# EAGLE design e_book_reader (EAGLE 9.7.0)
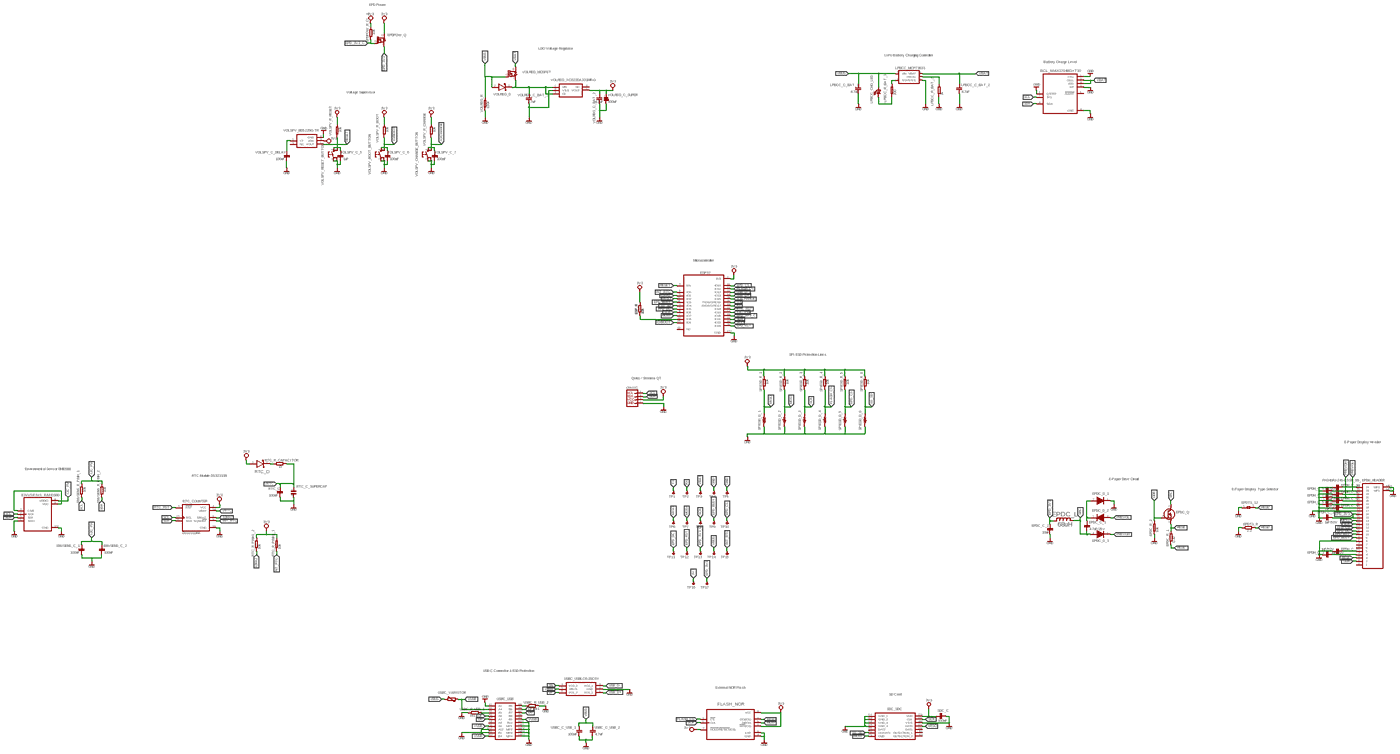
[diagram p0: schematic, sheet 1, overview]
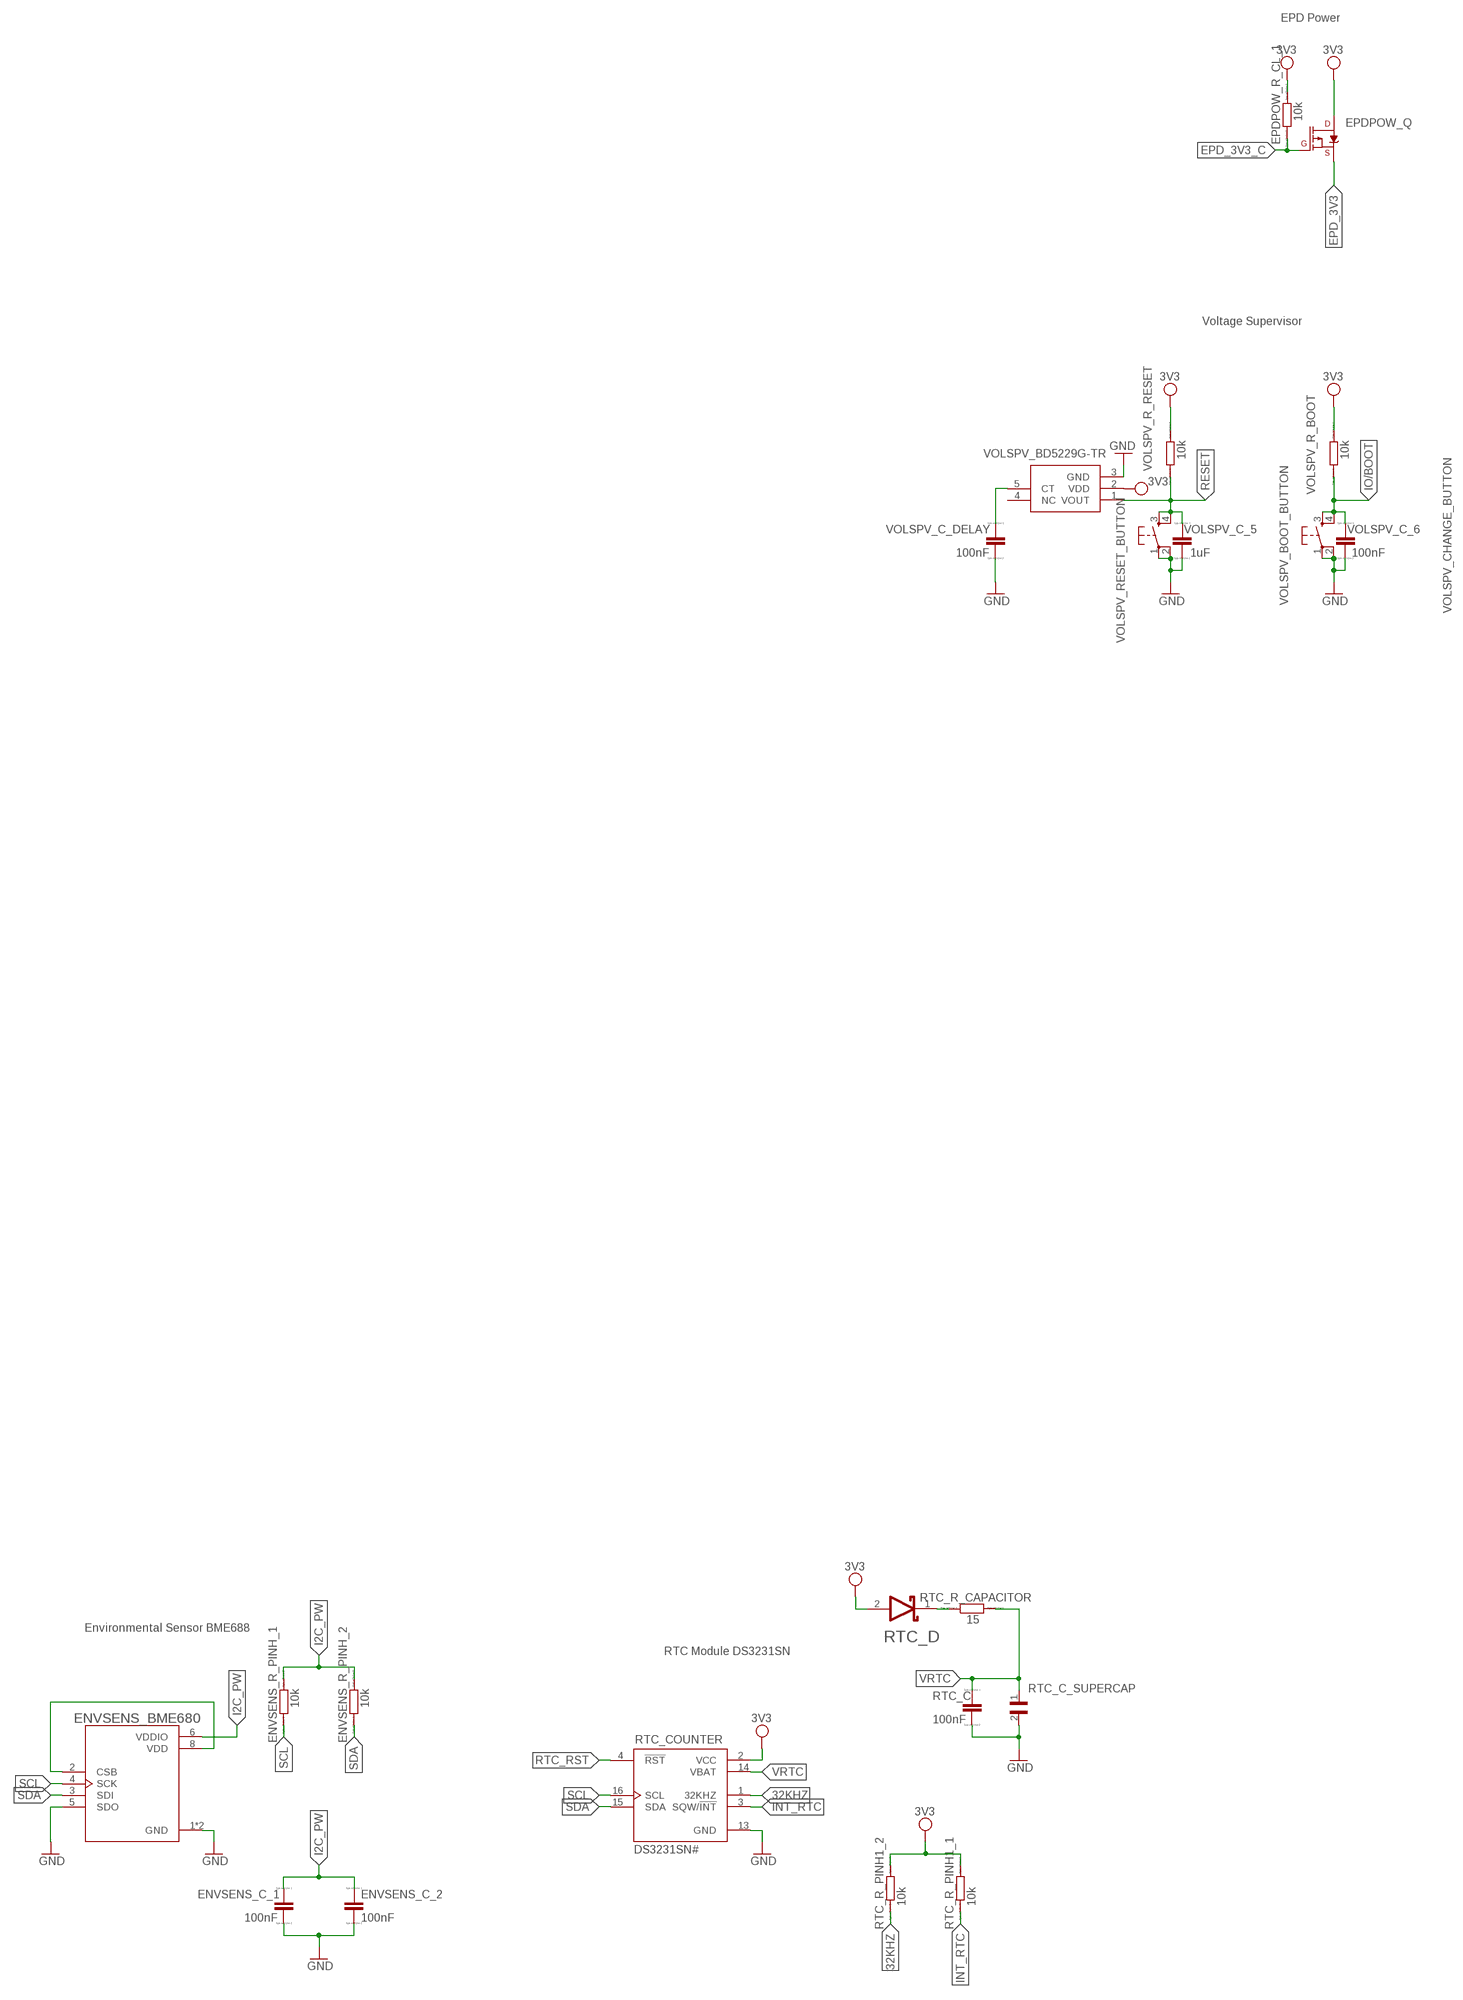
[diagram p1: schematic, sheet 1, part 1 of 5]
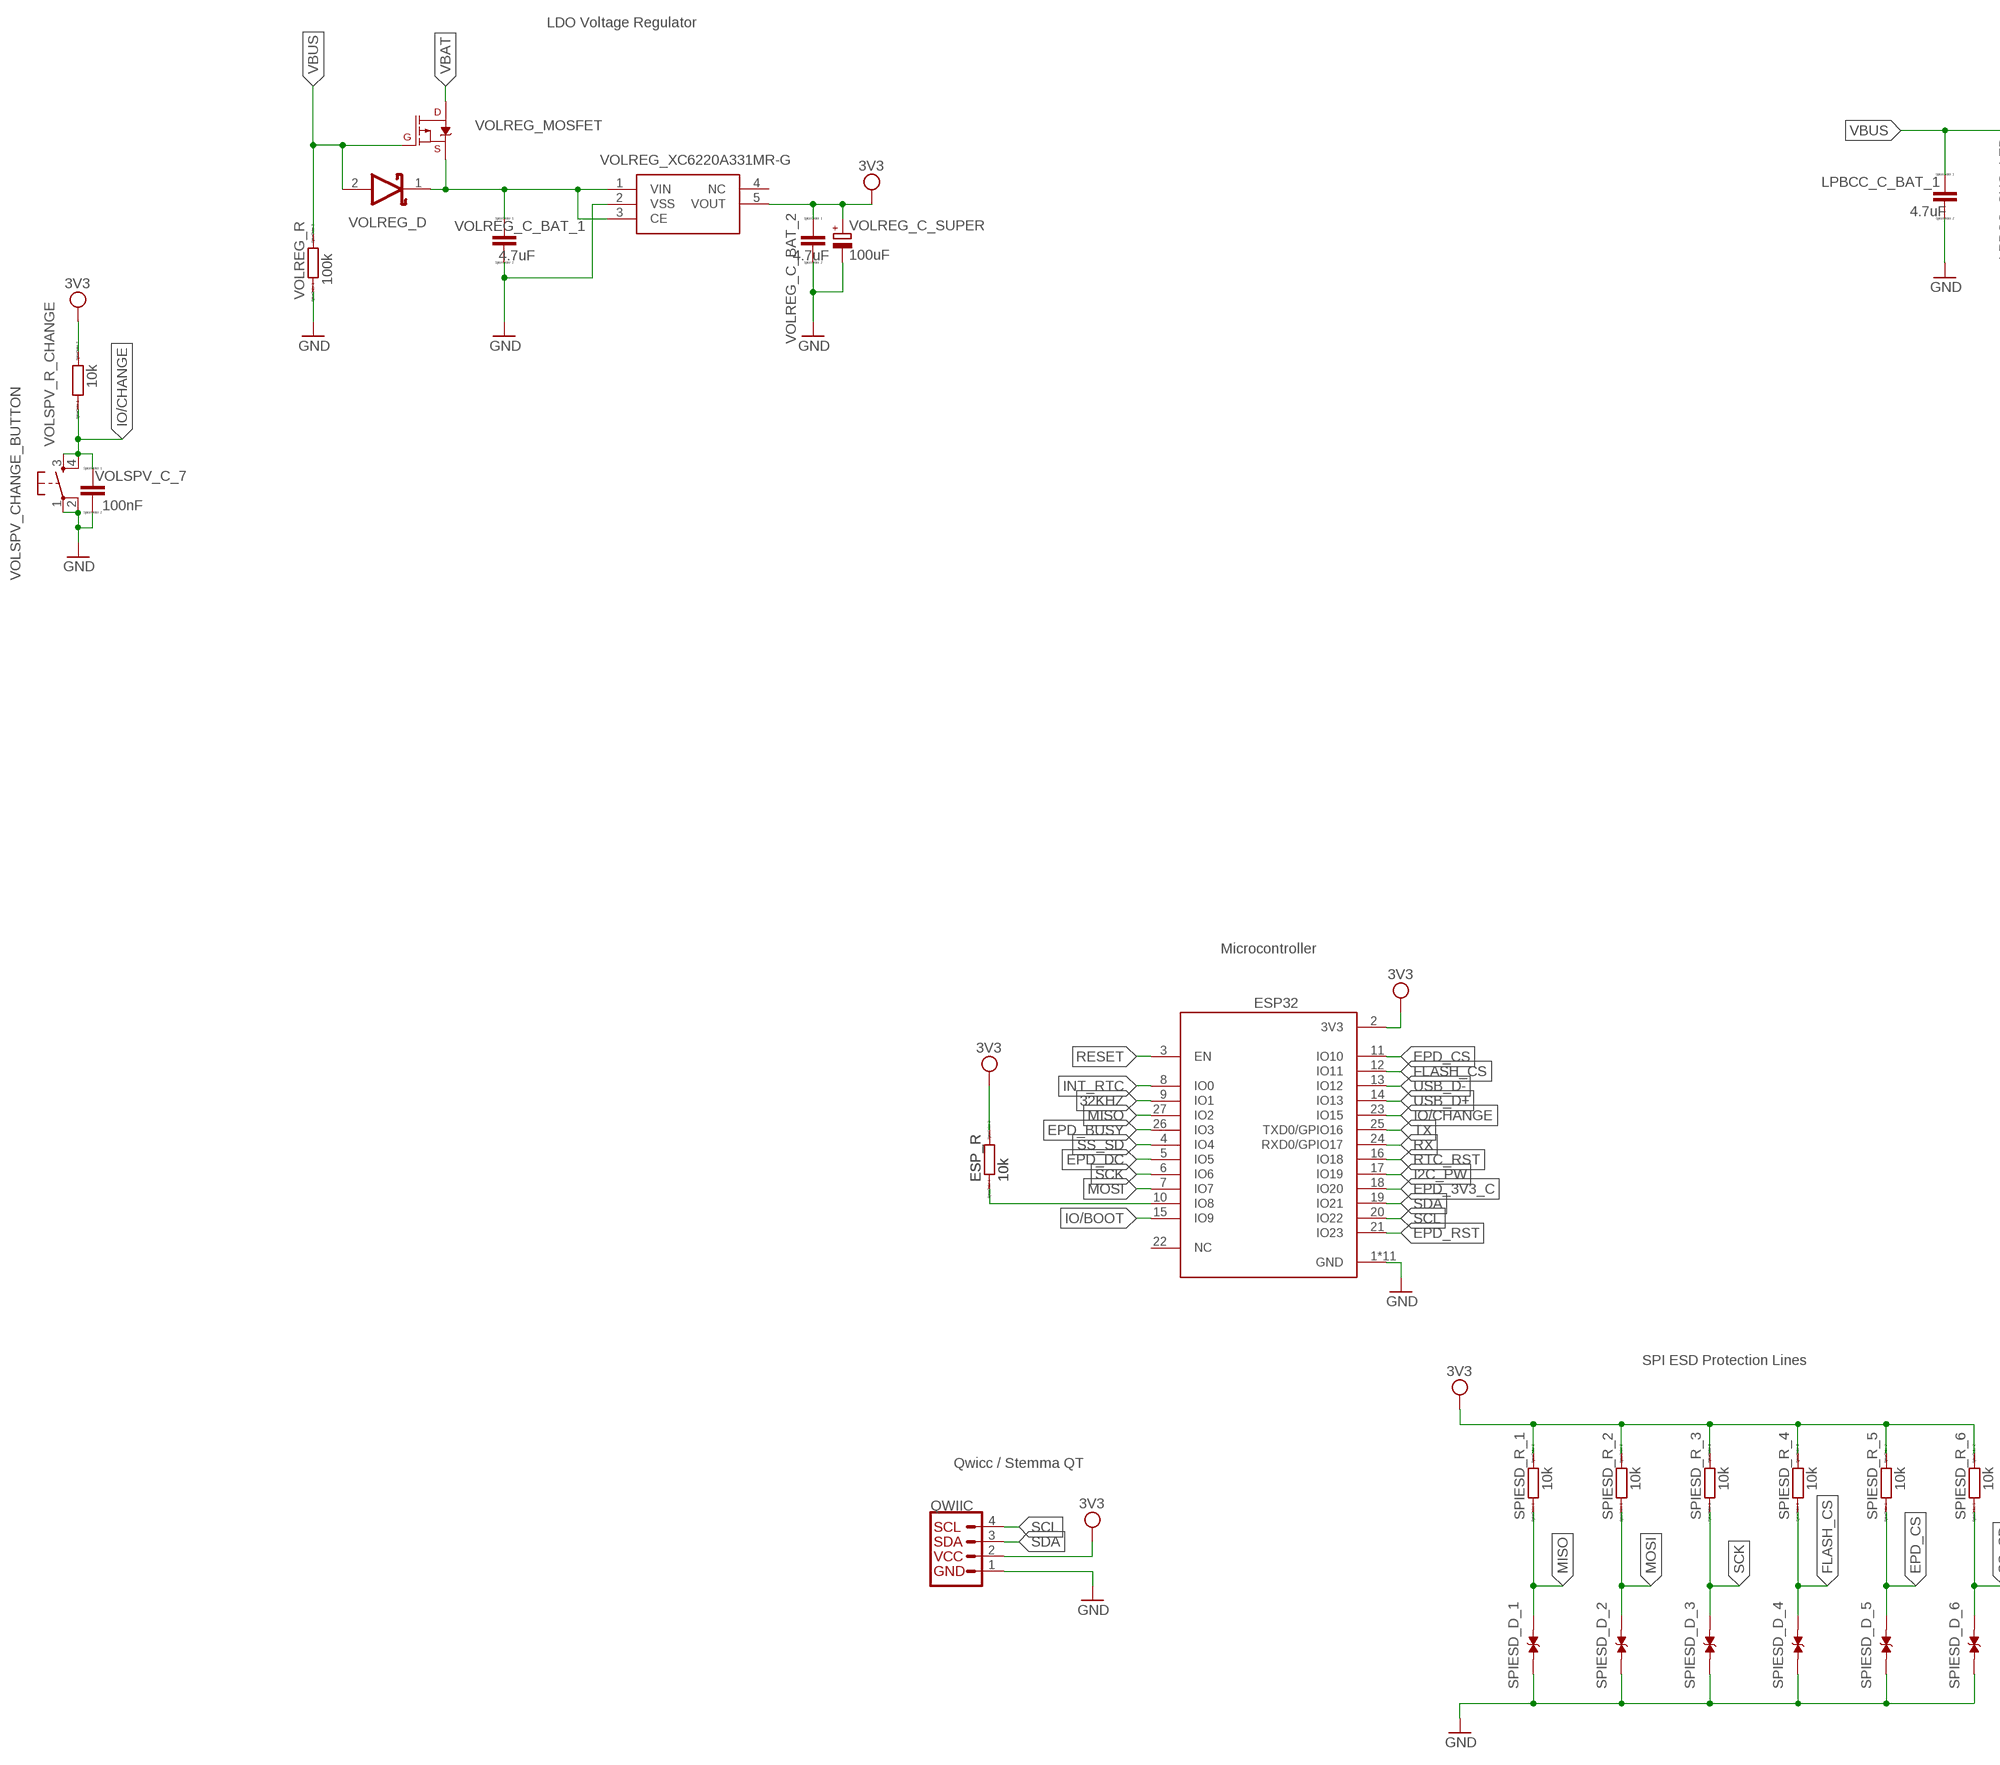
[diagram p2: schematic, sheet 1, part 2 of 5]
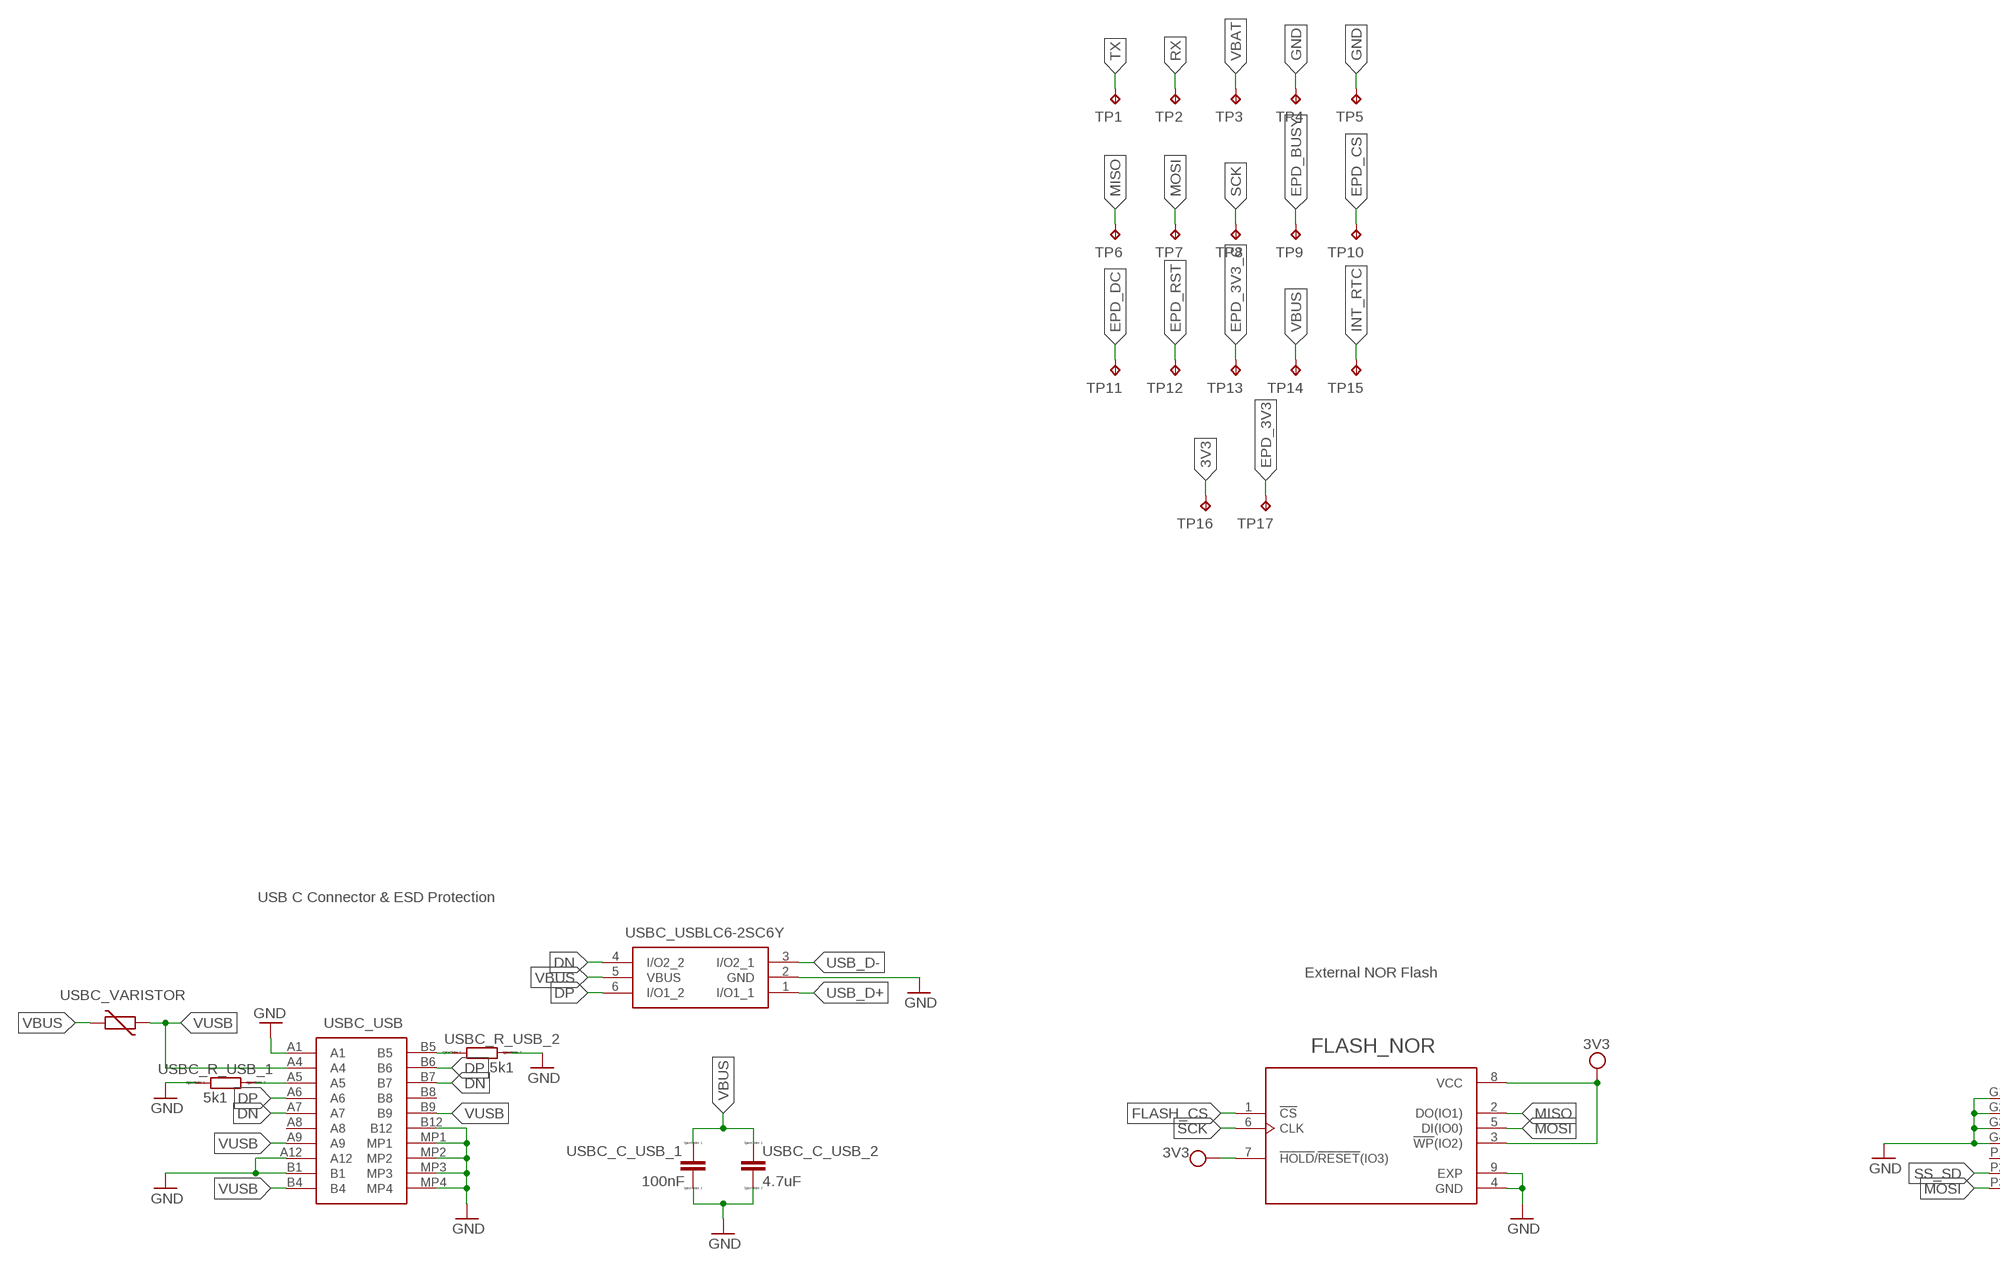
[diagram p3: schematic, sheet 1, part 3 of 5]
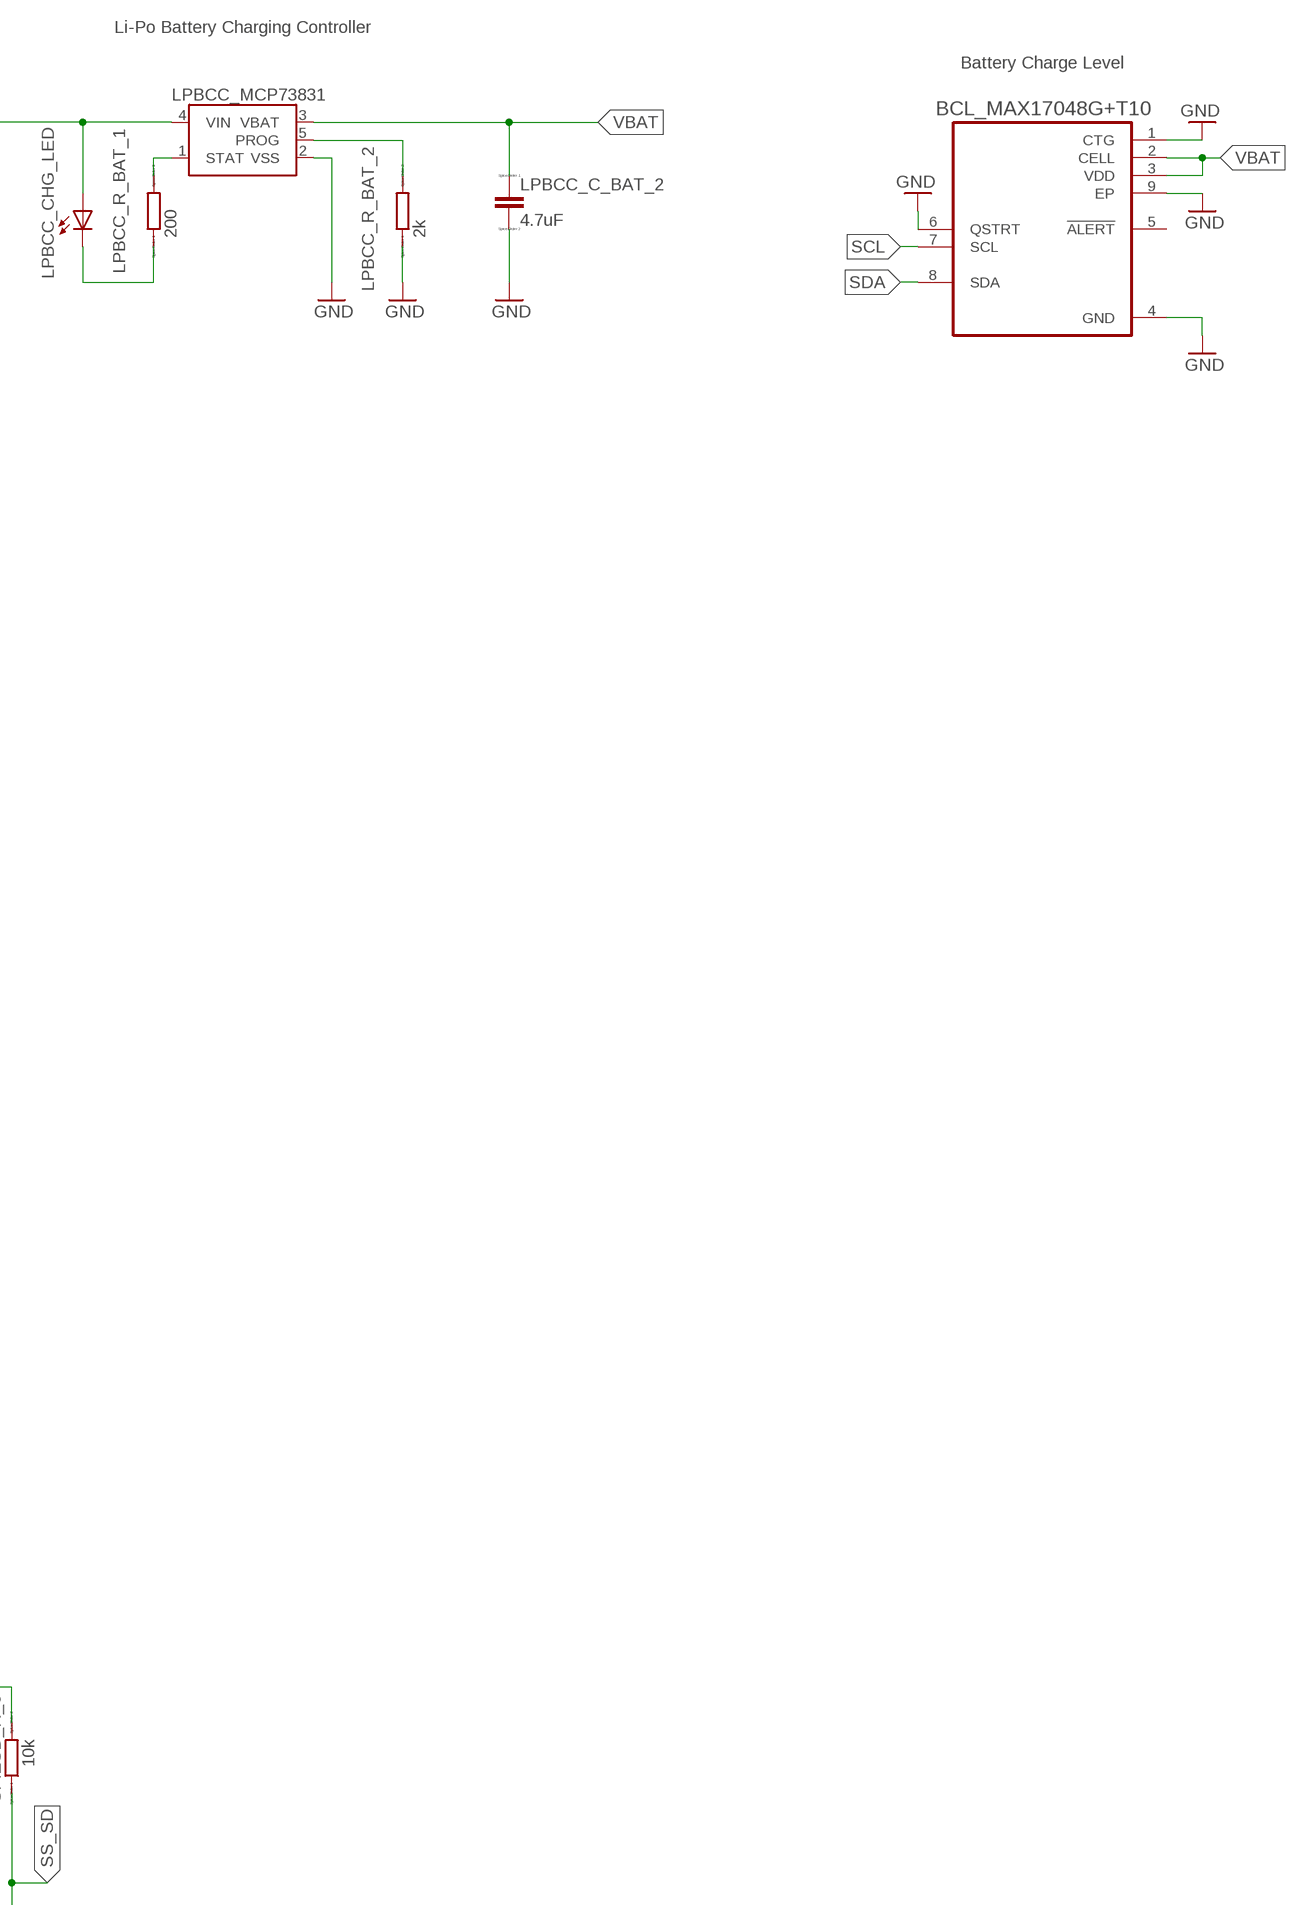
[diagram p4: schematic, sheet 1, part 4 of 5]
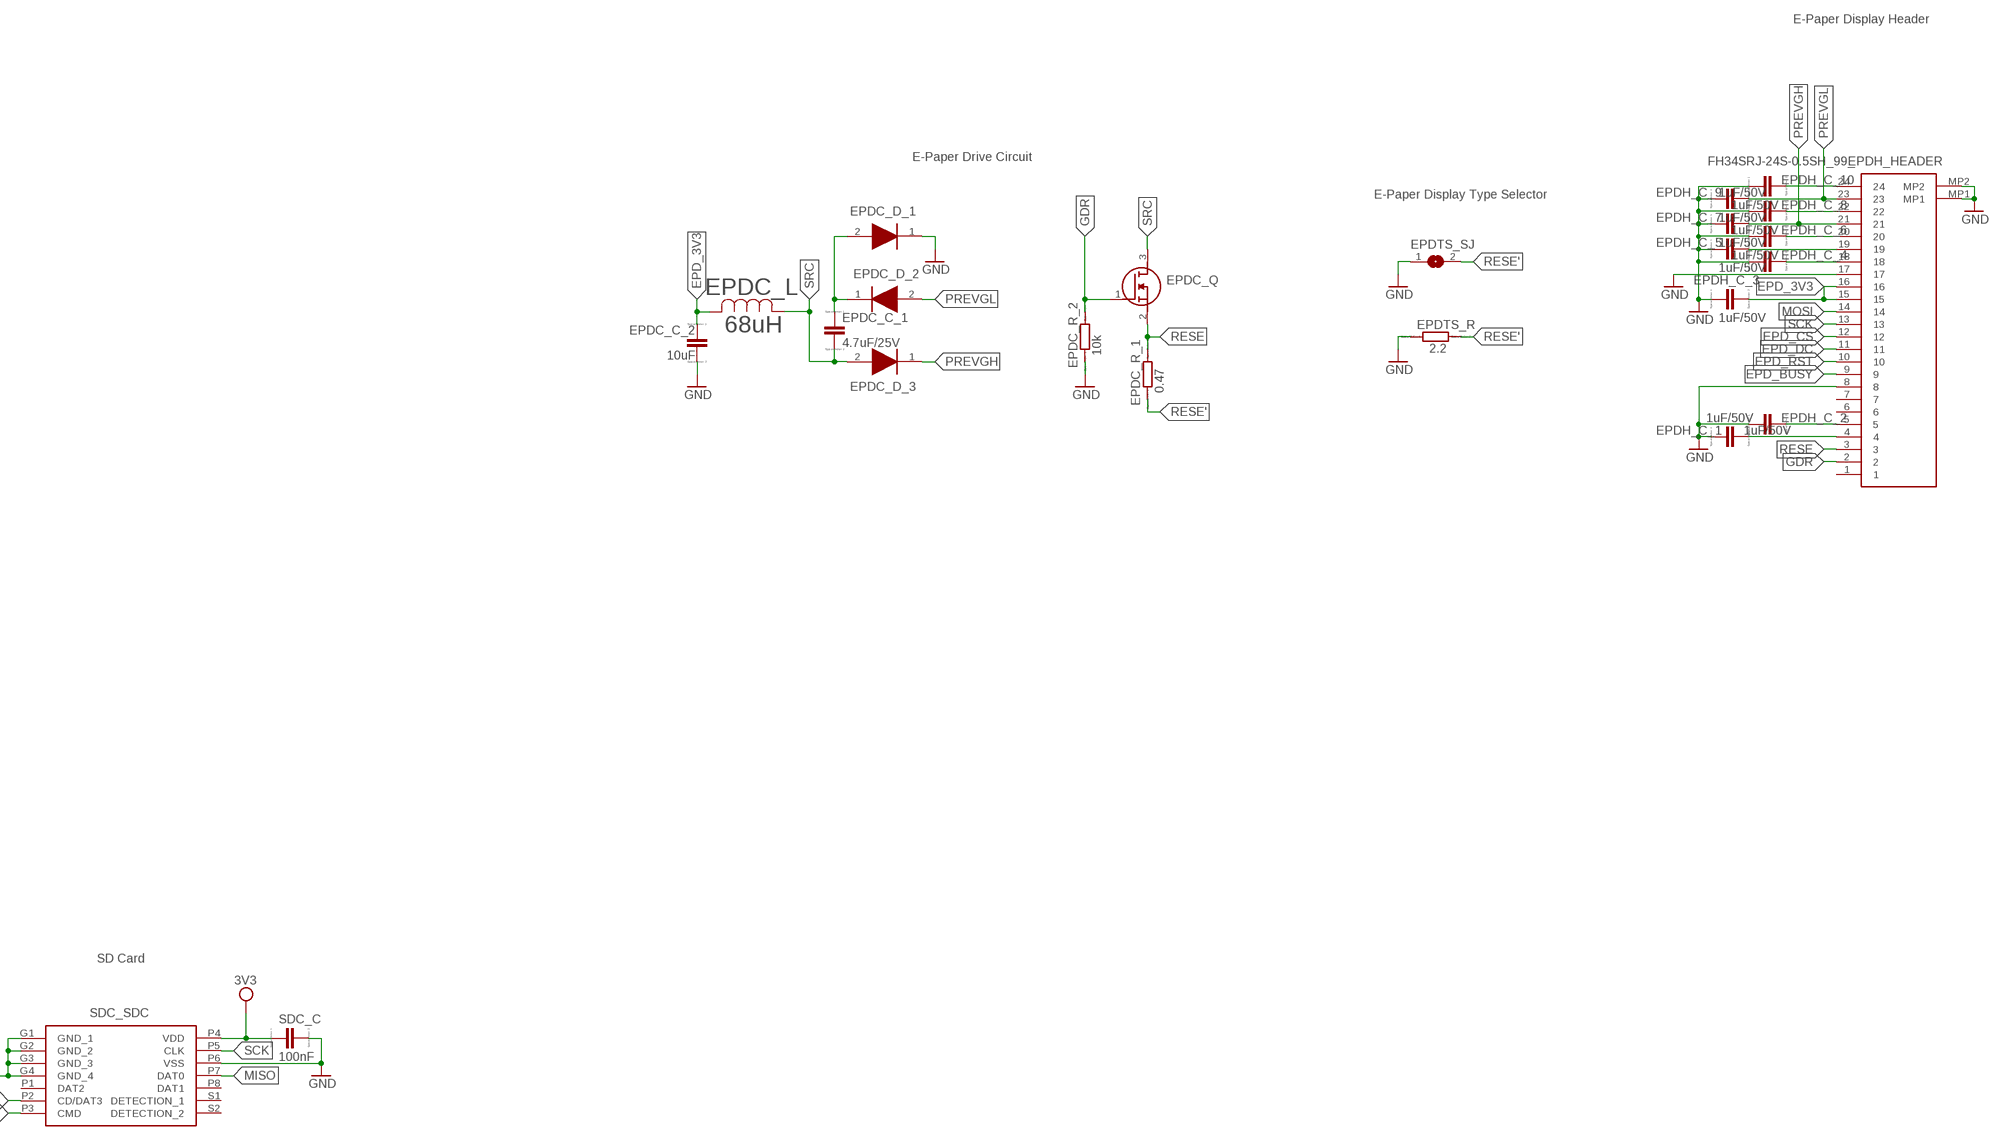
[diagram p5: schematic, sheet 1, part 5 of 5]

## Parts
BCL_MAX17048G+T10  MAX17048G+T10  [SON50P200X200X80-9N]
ENVSENS_BME680  ESP32_WROVER_BME680_BME680  [ESP32_WROVER_BME680_PSON80P300X300X100-8N]
ENVSENS_C_1  100nF  EAGLE-LTSPICE_CC0402  [EAGLE-LTSPICE_C0402]
ENVSENS_C_2  100nF  EAGLE-LTSPICE_CC0402  [EAGLE-LTSPICE_C0402]
ENVSENS_R_PINH_1  10k  ESP32_WROVER_EAGLE-LTSPICE_RR0402  [ESP32_WROVER_EAGLE-LTSPICE_R0402]
ENVSENS_R_PINH_2  10k  ESP32_WROVER_EAGLE-LTSPICE_RR0402  [ESP32_WROVER_EAGLE-LTSPICE_R0402]
EPDC_C_1  4.7uF/25V  EAGLE-LTSPICE_CC0402  [EAGLE-LTSPICE_C0402]
EPDC_C_2  10uF  EAGLE-LTSPICE_CC0402  [EAGLE-LTSPICE_C0402]
EPDC_D_1  MBR0530  [SOD3716X135N]
EPDC_D_2  MBR0530  [SOD3716X135N]
EPDC_D_3  MBR0530  [SOD3716X135N]
EPDC_L  68uH  744043680IND_4828-WE-TPC_WRE  [IND_4828-WE-TPC_WRE]
EPDC_Q  SI1308EDL-T1-GE3  [SOT65P210X110-3N]
EPDC_R_1  0.47  ESP32_WROVER_EAGLE-LTSPICE_RR0402  [ESP32_WROVER_EAGLE-LTSPICE_R0402]
EPDC_R_2  10k  ESP32_WROVER_EAGLE-LTSPICE_RR0402  [ESP32_WROVER_EAGLE-LTSPICE_R0402]
EPDH_C_1  1uF/50V  EAGLE-LTSPICE_CC0402  [EAGLE-LTSPICE_C0402]
EPDH_C_2  1uF/50V  EAGLE-LTSPICE_CC0402  [EAGLE-LTSPICE_C0402]
EPDH_C_3  1uF/50V  EAGLE-LTSPICE_CC0402  [EAGLE-LTSPICE_C0402]
EPDH_C_4  1uF/50V  EAGLE-LTSPICE_CC0402  [EAGLE-LTSPICE_C0402]
EPDH_C_5  1uF/50V  EAGLE-LTSPICE_CC0402  [EAGLE-LTSPICE_C0402]
EPDH_C_6  1uF/50V  EAGLE-LTSPICE_CC0402  [EAGLE-LTSPICE_C0402]
EPDH_C_7  1uF/50V  EAGLE-LTSPICE_CC0402  [EAGLE-LTSPICE_C0402]
EPDH_C_8  1uF/50V  EAGLE-LTSPICE_CC0402  [EAGLE-LTSPICE_C0402]
EPDH_C_9  1uF/50V  EAGLE-LTSPICE_CC0402  [EAGLE-LTSPICE_C0402]
EPDH_C_10  1uF/50V  EAGLE-LTSPICE_CC0402  [EAGLE-LTSPICE_C0402]
EPDH_HEADER  FH34SRJ-24S-0.5SH_99_  [FH34SRJ24S05SH99]
EPDPOW_Q  20V/4.2A/52mΩ/1.4W  ESP32_WROVER_SPARKFUN-DISCRETESEMI_MOSFET_PCH-DMG2305UX-7  [ESP32_WROVER_SPARKFUN-DISCRETESEMI_SOT23-3]
EPDPOW_R_CL_1  10k  ESP32_WROVER_EAGLE-LTSPICE_RR0402  [ESP32_WROVER_EAGLE-LTSPICE_R0402]
EPDTS_R  2.2  ESP32_WROVER_EAGLE-LTSPICE_RR0402  [ESP32_WROVER_EAGLE-LTSPICE_R0402]
EPDTS_SJ  SJ  [SJ]
ESP32  ESP32-C6-WROOM-1-N8  [XCVR_ESP32-C6-WROOM-1-N8]
ESP_R  10k  ESP32_WROVER_EAGLE-LTSPICE_RR0402  [ESP32_WROVER_EAGLE-LTSPICE_R0402]
FLASH_NOR  W25Q512JVEIQ  [SON127P600X800X80-9N]
LPBCC_C_BAT_1  4.7uF  EAGLE-LTSPICE_CC0402  [EAGLE-LTSPICE_C0402]
LPBCC_C_BAT_2  4.7uF  EAGLE-LTSPICE_CC0402  [EAGLE-LTSPICE_C0402]
LPBCC_CHG_LED  ADAFRUIT_LED  [ADAFRUIT_CHIP-LED0603]
LPBCC_MCP73831  ESP32_WROVER_SPARKFUN-IC-POWER_MCP73831  [ESP32_WROVER_SPARKFUN-IC-POWER_SOT23-5]
LPBCC_R_BAT_1  200  ESP32_WROVER_EAGLE-LTSPICE_RR0402  [ESP32_WROVER_EAGLE-LTSPICE_R0402]
LPBCC_R_BAT_2  2k  ESP32_WROVER_EAGLE-LTSPICE_RR0402  [ESP32_WROVER_EAGLE-LTSPICE_R0402]
QWIIC  QWIIC_RIGHT_ANGLE  QWIIC_CONNECTORJS-1MM  [JST04_1MM_RA]
RTC_C  100nF  EAGLE-LTSPICE_CC0402  [EAGLE-LTSPICE_C0402]
RTC_C_SUPERCAP  CPH3225A  [CAPCP3225X100N]
RTC_COUNTER  DS3231SN#  [SOIC127P1032X265-16N]
RTC_D  ESP32_WROVER_AVX---SD0805S020S1R0_AVX_SD0805S020S1R0_0_0AVX_SD0805S020S1R0_0_0  [ESP32_WROVER_AVX---SD0805S020S1R0_AVX_SD0805S020S1R0_0]
RTC_R_CAPACITOR  15  ESP32_WROVER_EAGLE-LTSPICE_RR0402  [ESP32_WROVER_EAGLE-LTSPICE_R0402]
RTC_R_PINH1_1  10k  ESP32_WROVER_EAGLE-LTSPICE_RR0402  [ESP32_WROVER_EAGLE-LTSPICE_R0402]
RTC_R_PINH1_2  10k  ESP32_WROVER_EAGLE-LTSPICE_RR0402  [ESP32_WROVER_EAGLE-LTSPICE_R0402]
SDC_C  100nF  EAGLE-LTSPICE_CC0402  [EAGLE-LTSPICE_C0402]
SDC_SDC  112A-TAAR-R03_ATTEND  [112ATAARR03ATTEND]
SPIESD_D_1  PGB1010603MR  [DIOC1608X36N]
SPIESD_D_2  PGB1010603MR  [DIOC1608X36N]
SPIESD_D_3  PGB1010603MR  [DIOC1608X36N]
SPIESD_D_4  PGB1010603MR  [DIOC1608X36N]
SPIESD_D_5  PGB1010603MR  [DIOC1608X36N]
SPIESD_D_6  PGB1010603MR  [DIOC1608X36N]
SPIESD_R_1  10k  ESP32_WROVER_EAGLE-LTSPICE_RR0402  [ESP32_WROVER_EAGLE-LTSPICE_R0402]
SPIESD_R_2  10k  ESP32_WROVER_EAGLE-LTSPICE_RR0402  [ESP32_WROVER_EAGLE-LTSPICE_R0402]
SPIESD_R_3  10k  ESP32_WROVER_EAGLE-LTSPICE_RR0402  [ESP32_WROVER_EAGLE-LTSPICE_R0402]
SPIESD_R_4  10k  ESP32_WROVER_EAGLE-LTSPICE_RR0402  [ESP32_WROVER_EAGLE-LTSPICE_R0402]
SPIESD_R_5  10k  ESP32_WROVER_EAGLE-LTSPICE_RR0402  [ESP32_WROVER_EAGLE-LTSPICE_R0402]
SPIESD_R_6  10k  ESP32_WROVER_EAGLE-LTSPICE_RR0402  [ESP32_WROVER_EAGLE-LTSPICE_R0402]
TP1  TPTP20R  [TP20R]
TP2  TPTP20R  [TP20R]
TP3  TPTP20R  [TP20R]
TP4  TPTP20R  [TP20R]
TP5  TPTP20R  [TP20R]
TP6  TPTP20R  [TP20R]
TP7  TPTP20R  [TP20R]
TP8  TPTP20R  [TP20R]
TP9  TPTP20R  [TP20R]
TP10  TPTP20R  [TP20R]
TP11  TPTP20R  [TP20R]
TP12  TPTP20R  [TP20R]
TP13  TPTP20R  [TP20R]
TP14  TPTP20R  [TP20R]
TP15  TPTP20R  [TP20R]
TP16  TPTP20R  [TP20R]
TP17  TPTP20R  [TP20R]
USBC_C_USB_1  100nF  EAGLE-LTSPICE_CC0402  [EAGLE-LTSPICE_C0402]
USBC_C_USB_2  4.7uF  EAGLE-LTSPICE_CC0402  [EAGLE-LTSPICE_C0402]
USBC_R_USB_1  5k1  ESP32_WROVER_EAGLE-LTSPICE_RR0402  [ESP32_WROVER_EAGLE-LTSPICE_R0402]
USBC_R_USB_2  5k1  ESP32_WROVER_EAGLE-LTSPICE_RR0402  [ESP32_WROVER_EAGLE-LTSPICE_R0402]
USBC_USB  SAMACSYS_PARTS_USB4110-GF-A  [SAMACSYS_PARTS_USB4110GFA]
USBC_USBLC6-2SC6Y  USBLC6-2SC6Y  [SOT95P280X145-6N]
USBC_VARISTOR  ESP32C6_VARISTORCN1812  [ESP32C6_VARISTOR_CT/CN1812]
VOLREG_C_BAT_1  4.7uF  EAGLE-LTSPICE_CC0402  [EAGLE-LTSPICE_C0402]
VOLREG_C_BAT_2  4.7uF  EAGLE-LTSPICE_CC0402  [EAGLE-LTSPICE_C0402]
VOLREG_C_SUPER  100uF  RCL_CPOL-EUCT3528  [RCL_CT3528]
VOLREG_D  ESP32_WROVER_AVX---SD0805S020S1R0_AVX_SD0805S020S1R0_0_0AVX_SD0805S020S1R0_0_0  [ESP32_WROVER_AVX---SD0805S020S1R0_AVX_SD0805S020S1R0_0]
VOLREG_MOSFET  20V/4.2A/52mΩ/1.4W  ESP32_WROVER_SPARKFUN-DISCRETESEMI_MOSFET_PCH-DMG2305UX-7  [ESP32_WROVER_SPARKFUN-DISCRETESEMI_SOT23-3]
VOLREG_R  100k  ESP32_WROVER_EAGLE-LTSPICE_RR0402  [ESP32_WROVER_EAGLE-LTSPICE_R0402]
VOLREG_XC6220A331MR-G  XC6220A331MR-G  [SOT95P280X125-5N]
VOLSPV_BD5229G-TR  BD5229G-TR  [SOT95P280X125-5N]
VOLSPV_BOOT_BUTTON  BUTTON_CUSYOMV1  [MYBUTTON]
VOLSPV_C_5  1uF  EAGLE-LTSPICE_CC0402  [EAGLE-LTSPICE_C0402]
VOLSPV_C_6  100nF  EAGLE-LTSPICE_CC0402  [EAGLE-LTSPICE_C0402]
VOLSPV_C_7  100nF  EAGLE-LTSPICE_CC0402  [EAGLE-LTSPICE_C0402]
VOLSPV_C_DELAY  100nF  EAGLE-LTSPICE_CC0402  [EAGLE-LTSPICE_C0402]
VOLSPV_CHANGE_BUTTON  BUTTON_CUSYOMV1  [MYBUTTON]
VOLSPV_R_BOOT  10k  ESP32_WROVER_EAGLE-LTSPICE_RR0402  [ESP32_WROVER_EAGLE-LTSPICE_R0402]
VOLSPV_R_CHANGE  10k  ESP32_WROVER_EAGLE-LTSPICE_RR0402  [ESP32_WROVER_EAGLE-LTSPICE_R0402]
VOLSPV_R_RESET  10k  ESP32_WROVER_EAGLE-LTSPICE_RR0402  [ESP32_WROVER_EAGLE-LTSPICE_R0402]
VOLSPV_RESET_BUTTON  BUTTON_CUSYOMV1  [MYBUTTON]

## Nets
3V3 [power]: EPDPOW_Q.3(D) EPDPOW_R_CL_1.2 ESP32.2(3V3) ESP_R.2 FLASH_NOR.3(!WP!(IO2)) FLASH_NOR.7(!HOLD!/!RESET!(IO3)) FLASH_NOR.8(VCC) QWIIC.2 RTC_COUNTER.2(VCC) RTC_D.2(ANODE) RTC_R_PINH1_1.2 RTC_R_PINH1_2.2 SDC_C.1 SDC_SDC.P4(VDD) SPIESD_R_1.2 SPIESD_R_2.2 SPIESD_R_3.2 SPIESD_R_4.2 SPIESD_R_5.2 SPIESD_R_6.2 TP16.TP VOLREG_C_BAT_2.1 VOLREG_C_SUPER.+ VOLREG_XC6220A331MR-G.5(VOUT) VOLSPV_BD5229G-TR.2(VDD) VOLSPV_R_BOOT.2 VOLSPV_R_CHANGE.2 VOLSPV_R_RESET.2
32KHZ [signal]: ESP32.9(IO1) RTC_COUNTER.1(32KHZ) RTC_R_PINH1_2.1
DN [signal]: USBC_USB.A7 USBC_USB.B7 USBC_USBLC6-2SC6Y.4(I/O2_2)
DP [signal]: USBC_USB.A6 USBC_USB.B6 USBC_USBLC6-2SC6Y.6(I/O1_2)
EPD_3V3 [power]: EPDC_C_2.1 EPDC_L.2 EPDH_C_3.2 EPDH_HEADER.15 EPDH_HEADER.16 EPDPOW_Q.2(S) TP17.TP
EPD_3V3_C [power]: EPDPOW_Q.1(G) EPDPOW_R_CL_1.1 ESP32.18(IO20) TP13.TP
EPD_BUSY [signal]: EPDH_HEADER.9 ESP32.26(IO3) TP9.TP
EPD_CS [signal]: EPDH_HEADER.12 ESP32.11(IO10) SPIESD_D_5.2 SPIESD_R_5.1 TP10.TP
EPD_DC [signal]: EPDH_HEADER.11 ESP32.5(IO5) TP11.TP
EPD_RST [signal]: EPDH_HEADER.10 ESP32.21(IO23) TP12.TP
FLASH_CS [signal]: ESP32.12(IO11) FLASH_NOR.1(!CS) SPIESD_D_4.2 SPIESD_R_4.1
GDR [signal]: EPDC_Q.1(G) EPDC_R_2.2 EPDH_HEADER.2
GND [signal]: BCL_MAX17048G+T10.1(CTG) BCL_MAX17048G+T10.4(GND) BCL_MAX17048G+T10.6(QSTRT) BCL_MAX17048G+T10.9(EP) ENVSENS_BME680.1(GND) ENVSENS_BME680.5(SDO) ENVSENS_BME680.7(GND) ENVSENS_C_1.2 ENVSENS_C_2.2 EPDC_C_2.2 EPDC_D_1.1(K) EPDC_R_2.1 EPDH_C_1.1 EPDH_C_2.1 EPDH_C_3.1 EPDH_C_4.1 EPDH_C_5.1 EPDH_C_6.1 EPDH_C_7.1 EPDH_C_8.1 EPDH_C_9.1 EPDH_C_10.1 EPDH_HEADER.8 EPDH_HEADER.17 EPDH_HEADER.MP1 EPDH_HEADER.MP2 EPDTS_R.1 EPDTS_SJ.1 ESP32.1(GND) ESP32.28(GND) ESP32.29_1(GND) ESP32.29_2(GND) ESP32.29_3(GND) ESP32.29_4(GND) ESP32.29_5(GND) ESP32.29_6(GND) ESP32.29_7(GND) ESP32.29_8(GND) ESP32.29_9(GND) FLASH_NOR.4(GND) FLASH_NOR.9(EXP) LPBCC_C_BAT_1.2 LPBCC_C_BAT_2.2 LPBCC_MCP73831.2(VSS) LPBCC_R_BAT_2.1 QWIIC.1 RTC_C.2 RTC_C_SUPERCAP.2 RTC_COUNTER.13(GND) SDC_C.2 SDC_SDC.G1(GND_1) SDC_SDC.G2(GND_2) SDC_SDC.G3(GND_3) SDC_SDC.G4(GND_4) SDC_SDC.P6(VSS) SPIESD_D_1.1 SPIESD_D_2.1 SPIESD_D_3.1 SPIESD_D_4.1 SPIESD_D_5.1 SPIESD_D_6.1 TP4.TP TP5.TP USBC_C_USB_1.2 USBC_C_USB_2.2 USBC_R_USB_1.1 USBC_R_USB_2.2 USBC_USB.A1 USBC_USB.A12 USBC_USB.B1 USBC_USB.B12 USBC_USB.MP1 USBC_USB.MP2 USBC_USB.MP3 USBC_USB.MP4 USBC_USBLC6-2SC6Y.2(GND) VOLREG_C_BAT_1.2 VOLREG_C_BAT_2.2 VOLREG_C_SUPER.- VOLREG_R.1 VOLREG_XC6220A331MR-G.2(VSS) VOLSPV_BD5229G-TR.3(GND) VOLSPV_BOOT_BUTTON.1 VOLSPV_BOOT_BUTTON.2 VOLSPV_C_5.2 VOLSPV_C_6.2 VOLSPV_C_7.2 VOLSPV_C_DELAY.2 VOLSPV_CHANGE_BUTTON.1 VOLSPV_CHANGE_BUTTON.2 VOLSPV_RESET_BUTTON.1 VOLSPV_RESET_BUTTON.2
I2C_PW [signal]: ENVSENS_BME680.6(VDDIO) ENVSENS_C_1.1 ENVSENS_C_2.1 ENVSENS_R_PINH_1.2 ENVSENS_R_PINH_2.2 ESP32.17(IO19)
INT_RTC [signal]: ESP32.8(IO0) RTC_COUNTER.3(SQW/!INT) RTC_R_PINH1_1.1 TP15.TP
IO/BOOT [signal]: ESP32.15(IO9) VOLSPV_BOOT_BUTTON.3 VOLSPV_BOOT_BUTTON.4 VOLSPV_C_6.1 VOLSPV_R_BOOT.1
IO/CHANGE [signal]: ESP32.23(IO15) VOLSPV_C_7.1 VOLSPV_CHANGE_BUTTON.3 VOLSPV_CHANGE_BUTTON.4 VOLSPV_R_CHANGE.1
MISO [signal]: ESP32.27(IO2) FLASH_NOR.2(DO(IO1)) SDC_SDC.P7(DAT0) SPIESD_D_1.2 SPIESD_R_1.1 TP6.TP
MOSI [signal]: EPDH_HEADER.14 ESP32.7(IO7) FLASH_NOR.5(DI(IO0)) SDC_SDC.P3(CMD) SPIESD_D_2.2 SPIESD_R_2.1 TP7.TP
N$1 [signal]: VOLREG_C_BAT_1.1 VOLREG_D.1(CATHODE) VOLREG_MOSFET.2(S) VOLREG_XC6220A331MR-G.1(VIN) VOLREG_XC6220A331MR-G.3(CE)
N$2 [signal]: VOLSPV_BD5229G-TR.5(CT) VOLSPV_C_DELAY.1
N$3 [signal]: LPBCC_MCP73831.1(STAT) LPBCC_R_BAT_1.2
N$4 [signal]: LPBCC_CHG_LED.C LPBCC_R_BAT_1.1
N$5 [signal]: ESP32.10(IO8) ESP_R.1
N$6 [signal]: LPBCC_MCP73831.5(PROG) LPBCC_R_BAT_2.2
N$7 [signal]: USBC_R_USB_2.1 USBC_USB.B5
N$8 [signal]: EPDH_C_10.2 EPDH_HEADER.24
N$9 [signal]: EPDC_C_1.1 EPDC_D_1.2(A) EPDC_D_2.1(K)
N$11 [signal]: EPDH_C_8.2 EPDH_HEADER.22
N$13 [signal]: ENVSENS_BME680.2(CSB) ENVSENS_BME680.8(VDD)
N$14 [signal]: RTC_D.1(CATHODE) RTC_R_CAPACITOR.1
N$15 [signal]: EPDH_C_6.2 EPDH_HEADER.20
N$16 [signal]: EPDH_C_5.2 EPDH_HEADER.19
N$17 [signal]: USBC_R_USB_1.2 USBC_USB.A5
N$18 [signal]: EPDH_C_4.2 EPDH_HEADER.18
N$20 [signal]: EPDH_C_2.2 EPDH_HEADER.5
N$21 [signal]: EPDH_C_1.2 EPDH_HEADER.4
PREVGH [signal]: EPDC_D_3.1(K) EPDH_C_7.2 EPDH_HEADER.21
PREVGL [signal]: EPDC_D_2.2(A) EPDH_C_9.2 EPDH_HEADER.23
RESE [signal]: EPDC_Q.2(S) EPDC_R_1.2 EPDH_HEADER.3
RESE' [signal]: EPDC_R_1.1 EPDTS_R.2 EPDTS_SJ.2
RESET [signal]: ESP32.3(EN) VOLSPV_BD5229G-TR.1(VOUT) VOLSPV_C_5.1 VOLSPV_R_RESET.1 VOLSPV_RESET_BUTTON.3 VOLSPV_RESET_BUTTON.4
RTC_RST [signal]: ESP32.16(IO18) RTC_COUNTER.4(!RST)
RX [signal]: ESP32.24(RXD0/GPIO17) TP2.TP
SCK [signal]: EPDH_HEADER.13 ESP32.6(IO6) FLASH_NOR.6(CLK) SDC_SDC.P5(CLK) SPIESD_D_3.2 SPIESD_R_3.1 TP8.TP
SCL [signal]: BCL_MAX17048G+T10.7(SCL) ENVSENS_BME680.4(SCK) ENVSENS_R_PINH_1.1 ESP32.20(IO22) QWIIC.4 RTC_COUNTER.16(SCL)
SDA [signal]: BCL_MAX17048G+T10.8(SDA) ENVSENS_BME680.3(SDI) ENVSENS_R_PINH_2.1 ESP32.19(IO21) QWIIC.3 RTC_COUNTER.15(SDA)
SRC [signal]: EPDC_C_1.2 EPDC_D_3.2(A) EPDC_L.1 EPDC_Q.3(D)
SS_SD [signal]: ESP32.4(IO4) SDC_SDC.P2(CD/DAT3) SPIESD_D_6.2 SPIESD_R_6.1
TX [signal]: ESP32.25(TXD0/GPIO16) TP1.TP
USB_D+ [signal]: ESP32.14(IO13) USBC_USBLC6-2SC6Y.1(I/O1_1)
USB_D- [signal]: ESP32.13(IO12) USBC_USBLC6-2SC6Y.3(I/O2_1)
VBAT [power]: BCL_MAX17048G+T10.2(CELL) BCL_MAX17048G+T10.3(VDD) LPBCC_C_BAT_2.1 LPBCC_MCP73831.3(VBAT) TP3.TP VOLREG_MOSFET.3(D)
VBUS [power]: LPBCC_C_BAT_1.1 LPBCC_CHG_LED.A LPBCC_MCP73831.4(VIN) TP14.TP USBC_C_USB_1.1 USBC_C_USB_2.1 USBC_USBLC6-2SC6Y.5(VBUS) USBC_VARISTOR.2 VOLREG_D.2(ANODE) VOLREG_MOSFET.1(G) VOLREG_R.2
VRTC [power]: RTC_C.1 RTC_C_SUPERCAP.1 RTC_COUNTER.14(VBAT) RTC_R_CAPACITOR.2
VUSB [power]: USBC_USB.A4 USBC_USB.A9 USBC_USB.B4 USBC_USB.B9 USBC_VARISTOR.1
Unconnected: BCL_MAX17048G+T10.5(!ALERT) EPDH_HEADER.1 EPDH_HEADER.6 EPDH_HEADER.7 ESP32.22(NC) SDC_SDC.P1(DAT2) SDC_SDC.P8(DAT1) SDC_SDC.S1(DETECTION_1) SDC_SDC.S2(DETECTION_2) USBC_USB.A8 USBC_USB.B8 VOLREG_XC6220A331MR-G.4(NC) VOLSPV_BD5229G-TR.4(NC)

## Notes on the sheet
- EPD Power
- LDO Voltage Regulator
- Li-Po Battery Charging Controller
- Battery Charge Level
- Voltage Supervisor
- Microcontroller
- SPI ESD Protection Lines
- Qwicc / Stemma QT
- E-Paper Display Header
- Environmental Sensor BME688
- RTC Module DS3231SN
- E-Paper Drive Circuit
- E-Paper Display Type Selector
- USB C Connector & ESD Protection
- External NOR Flash
- SD Card

## Library data of the parts
BCL_MAX17048G+T10 = EBR_Components:MAX17048G+T10: Check availability <https://pricing.snapeda.com/parts/MAX17048G%2BT10/Analog%20Devices/view-part?ref=eda>
ENVSENS_BME680 = EBR_Components:ESP32_WROVER_BME680_BME680: Integrated Environmental Unit
ENVSENS_C_1 ENVSENS_C_2 EPDC_C_1 EPDC_C_2 EPDH_C_1-EPDH_C_10 LPBCC_C_BAT_1 LPBCC_C_BAT_2 RTC_C SDC_C USBC_C_USB_1 USBC_C_USB_2 VOLREG_C_BAT_1 VOLREG_C_BAT_2 VOLSPV_C_5-VOLSPV_C_7 VOLSPV_C_DELAY = EBR_Components:EAGLE-LTSPICE_C: CAPACITOR, European symbol
ENVSENS_R_PINH_1 ENVSENS_R_PINH_2 EPDC_R_1 EPDC_R_2 EPDPOW_R_CL_1 EPDTS_R ESP_R LPBCC_R_BAT_1 LPBCC_R_BAT_2 RTC_R_CAPACITOR RTC_R_PINH1_1 RTC_R_PINH1_2 SPIESD_R_1-SPIESD_R_6 USBC_R_USB_1 USBC_R_USB_2 VOLREG_R VOLSPV_R_BOOT VOLSPV_R_CHANGE VOLSPV_R_RESET = EBR_Components:ESP32_WROVER_EAGLE-LTSPICE_R: RESISTOR, European symbol
EPDC_D_1-EPDC_D_3 = EBR_Components:MBR0530: ON SEMICONDUCTOR - MBR0530 - DIODE, SCHOTTKY, 0.5A, 30V, SOD-123 Source: Datasheet <http://www.onsemi.com/pub/Collateral/MBR0530T1-D.PDF> Check availability <https://pricing.snapeda.com/parts/MBR0530/ON%20Semiconductor/view-part?ref=eda>
EPDC_L = EBR_Components:744043680
EPDC_Q = EBR_Components:SI1308EDL-T1-GE3: MOSFET N-Ch 30V 1.5A TrenchFET SC70 Vishay Si1308EDL-T1-GE3 N-channel MOSFET Transistor, 1.5 A, 30 V, 3-Pin SC-70 Source: Datasheet <https://componentsearchengine.com/Datasheets/1/SI1308EDL-T1-GE3.pdf> Check availability <https://pricing.snapeda.com/parts/SI1308EDL-T1-GE3/Vishay%20Siliconix/view-part?ref=eda>
EPDH_HEADER = EBR_Components:FH34SRJ-24S-0.5SH_99_: 24 Position FFC, FPC Connector Contacts, Top and Bottom 0.020" (0.50mm) Surface Mount, Right Angle Source: Datasheet <https://www.hirose.com/en/product/document?clcode=CL0580-1255-6-99&productname=FH34SRJ-24S-0.5SH(99)&series=FH34SRJ&documenttype=2DDrawing&lang=en&documentid=0000990903>
EPDPOW_Q VOLREG_MOSFET = EBR_Components:ESP32_WROVER_SPARKFUN-DISCRETESEMI_MOSFET_PCH: P-channel MOSFETs Voltage controlled devices that allow control of high current outputs. SparkFun Products: SparkFun ESP32 Thing <https://www.sparkfun.com/products/13907> SparkFun ESP8266 Thing <https://www.sparkfun.com/products/13231> SparkFun Pi Servo HAT V2 <https://www.sparkfun.com/products/15316��> DMG2305UX-7 (20V/4.2A/SOT23-3)
EPDTS_SJ = EBR_Components:SJ: SMD solder JUMPER
ESP32 = EBR_Components:ESP32-C6-WROOM-1-N8: Check availability <https://pricing.snapeda.com/parts/ESP32-C6-WROOM-1-N8/Espressif%20Systems/view-part?ref=eda>; AVAILABILITY: In Stock; CHECK_PRICES: https://www.snapeda.com/parts/ESP32-C6-WROOM-1-N8/Espressif+Systems/view-part/?ref=eda; DESCRIPTION: Multiprotocol Modules ESP32-C6 module, Wi-Fi 6 in 2.4 GHz band, Bluetooth 5, Zigbee 3.0 and Thread. ESP34-WROOM Compatible - ENGINEERING SAMPLE; MF: Espressif Systems; MP: ESP32-C6-WROOM-1-N8; PACKAGE: None; PRICE: None; SNAPEDA_LINK: https://www.snapeda.com/parts/ESP32-C6-WROOM-1-N8/Espressif+Systems/view-part/?ref=snap
FLASH_NOR = EBR_Components:W25Q512JVEIQ: Check availability <https://pricing.snapeda.com/parts/W25Q512JVEIQ/Winbond%20Electronics/view-part?ref=eda>
LPBCC_CHG_LED = EBR_Components:ADAFRUIT_LED: LED OSRAM: - CHIPLED LG R971, LG N971, LY N971, LG Q971, LY Q971, LO R971, LY R971 LH N974, LH R974 LS Q976, LO Q976, LY Q976 LO Q996 - Hyper CHIPLED LW Q18S LB Q993, LB Q99A, LB R99A - SideLED LS A670, LO A670, LY A670, LG A670, LP A670 LB A673, LV A673, LT A673, LW A673 LH A674 LY A675 LS A676, LA A676, LO A676, LY A676, LW A676 LS A679, LY A679, LG A679 - Hyper Micro SIDELED® LS Y876, LA Y876, LO Y876, LY Y876 LT Y87S - SmartLED LW L88C, LW L88S LB L89C, LB L89S, LG L890 LS L89K, LO L89K, LY L89K LS L896, LA L896, LO L896, LY L896 - TOPLED LS T670, LO T670, LY T670, LG T670, LP T670 LSG T670, LSP T670, LSY T670, LOP T670, LYG T670 LG T671, LOG T671, LSG T671 LB T673, LV T673, LT T673, LW T673 LH T674 LS T676, LA T676, LO T676, LY T676, LB T676, LH T676, LSB T676, LW T676 LB T67C, LV T67C, LT T67C, LS T67K, LO T67K, LY T67K, LW E67C LS E67B, LA E67B, LO E67B, LY E67B, LB E67C, LV E67C, LT E67C LW T67C LS T679, LY T679, LG T679 LS T770, LO T770, LY T770, LG T770, LP T770 LB T773, LV T773, LT T773, LW T773 LH T774 LS E675, LA E675, LY E675, LS T675 LS T776, LA T776, LO T776, LY T776, LB T776 LHGB T686 LT T68C, LB T68C - Hyper Mini TOPLED® LB M676 - Mini TOPLED Santana® LG M470 LS M47K, LO M47K, LY M47K Source: http://www.osram.convergy.de/
LPBCC_MCP73831 = EBR_Components:ESP32_WROVER_SPARKFUN-IC-POWER_MCP73831: MCP73831T Li-Ion, Li-Pol Controller Miniature single cell, fully integrated Li-Ion, Li-polymer charge management controller Datasheet <http://ww1.microchip.com/downloads/en/DeviceDoc/20001984g.pdf> SparkFun Products: SparkFun ESP32 Thing <https://www.sparkfun.com/products/13907> SparkFun 9DoF Razor IMU M0 <https://www.sparkfun.com/products/14001>
QWIIC = EBR_Components:QWIIC_CONNECTOR: SparkFun I2C Standard Qwiic Connector An SMD 1mm pitch JST connector makes it easy and quick (get it? Qwiic?) to connect I2C devices to each other. The Qwiic system <http://www.sparkfun.com/qwiic> enables fast and solderless connection between popular platforms and various sensors and actuators. We carry 200mm <https://www.sparkfun.com/products/14204>, 100mm <https://www.sparkfun.com/products/14205>, 50mm <https://www.sparkfun.com/products/14206>, and breadboard friendly <https://www.sparkfun.com/products/14207> Qwiic cables. We also offer 10 pcs strips <https://www.sparkfun.com/products/14323> the SMD connectors.
RTC_C_SUPERCAP = EBR_Components:CPH3225A: Cap 0.011F 3.3V 1210 Flat Check availability <https://pricing.snapeda.com/parts/CPH3225A/Seiko%20Instruments/view-part?ref=eda>
RTC_COUNTER = EBR_Components:DS3231SN#: Real Time Clock Serial 16-Pin SOIC W T/R Check availability <https://pricing.snapeda.com/parts/DS3231SN%23/Analog%20Devices/view-part?ref=eda>
RTC_D VOLREG_D = EBR_Components:ESP32_WROVER_AVX---SD0805S020S1R0_AVX_SD0805S020S1R0_0_0: Schottky Barrier Rectifier Diode
SDC_SDC = EBR_Components:112A-TAAR-R03_ATTEND: Micro SD Card Socket, Push-Push Type, Top Mount, SMT, H=1.83mm, 10u Source: Datasheet <https://www.attend.com.tw/data/download/file/112A-TAAR-R03.pdf>
SPIESD_D_1-SPIESD_D_6 = EBR_Components:PGB1010603MR: Check availability <https://pricing.snapeda.com/parts/PGB1010603MR/Littelfuse%20Inc./view-part?ref=eda>
TP1-TP17 = EBR_Components:TP: Test pad
USBC_USB = EBR_Components:SAMACSYS_PARTS_USB4110-GF-A: CONN USB 2.0 TYPE-C R/A SMT Source: Datasheet <https://gct.co/files/drawings/usb4110.pdf>
USBC_USBLC6-2SC6Y = EBR_Components:USBLC6-2SC6Y: Low Cap. ESD Protection Auto SOT-23-6 STMicroelectronics USBLC6-2SC6Y, Dual Uni-Directional TVS Diode Array, 6-Pin SOT-23 Source: Datasheet <https://componentsearchengine.com/Datasheets/1/USBLC6-2SC6Y.pdf> Check availability <https://pricing.snapeda.com/parts/USBLC6-2SC6Y/STMicroelectronics/view-part?ref=eda>
USBC_VARISTOR = EBR_Components:ESP32C6_VARISTOR: VARISTOR
VOLREG_C_SUPER = EBR_Components:RCL_CPOL-EU: POLARIZED CAPACITOR, European symbol
VOLREG_XC6220A331MR-G = EBR_Components:XC6220A331MR-G: LDO Voltage Regulators Source: Datasheet <https://www.torexsemi.com/file/xc6220/XC6220.pdf>
VOLSPV_BD5229G-TR = EBR_Components:BD5229G-TR: Voltage Detector with Adjustable Delay Time: CMOS processes are utilized to develop high precision, low current consumption CMOS reset ICs that allow arbitrary setting of the delay time. The extensive lineup includes both Nch Open Drain and CMOS output types in a wide range of detection voltages (from 2.3V to 6.0V, in 0.1V steps), enabling selection of the ideal solution based on customer requirements. In addition, the entire series is of course both lead-free and RoHS-compliant. Source: Datasheet <https://datasheet.datasheetarchive.com/originals/distributors/Datasheets_SAMA/f2b9741ef86007909f138d561a359946.pdf>
VOLSPV_BOOT_BUTTON VOLSPV_CHANGE_BUTTON VOLSPV_RESET_BUTTON = EBR_Components:BUTTON_CUSYOMV1

## Net classes
1 signal: width 0.15 mm
2 power: width 0.3 mm

## Board
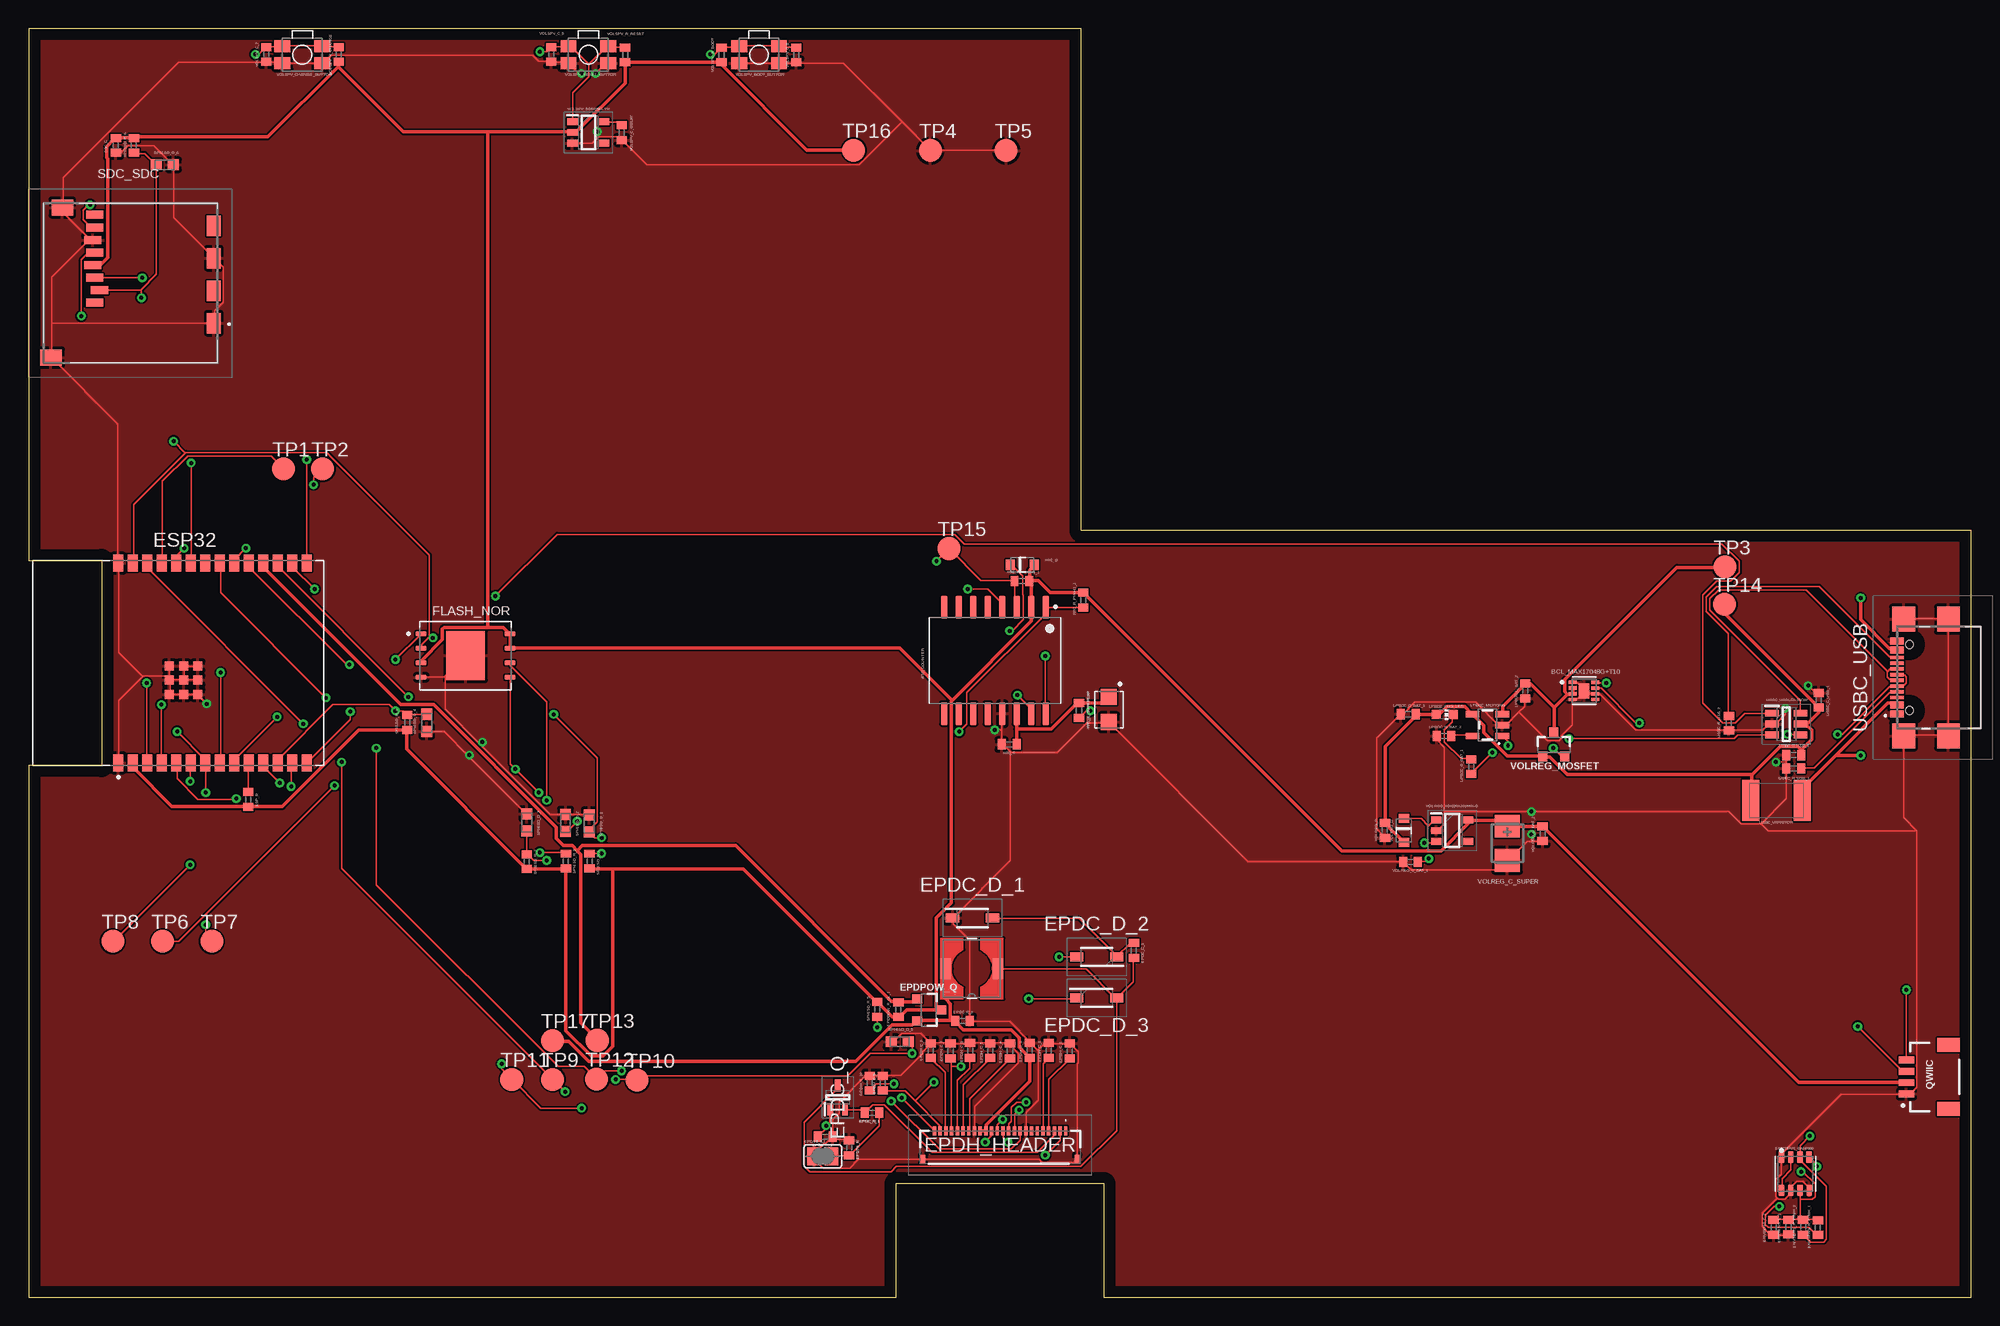
[diagram p6: board, top side]
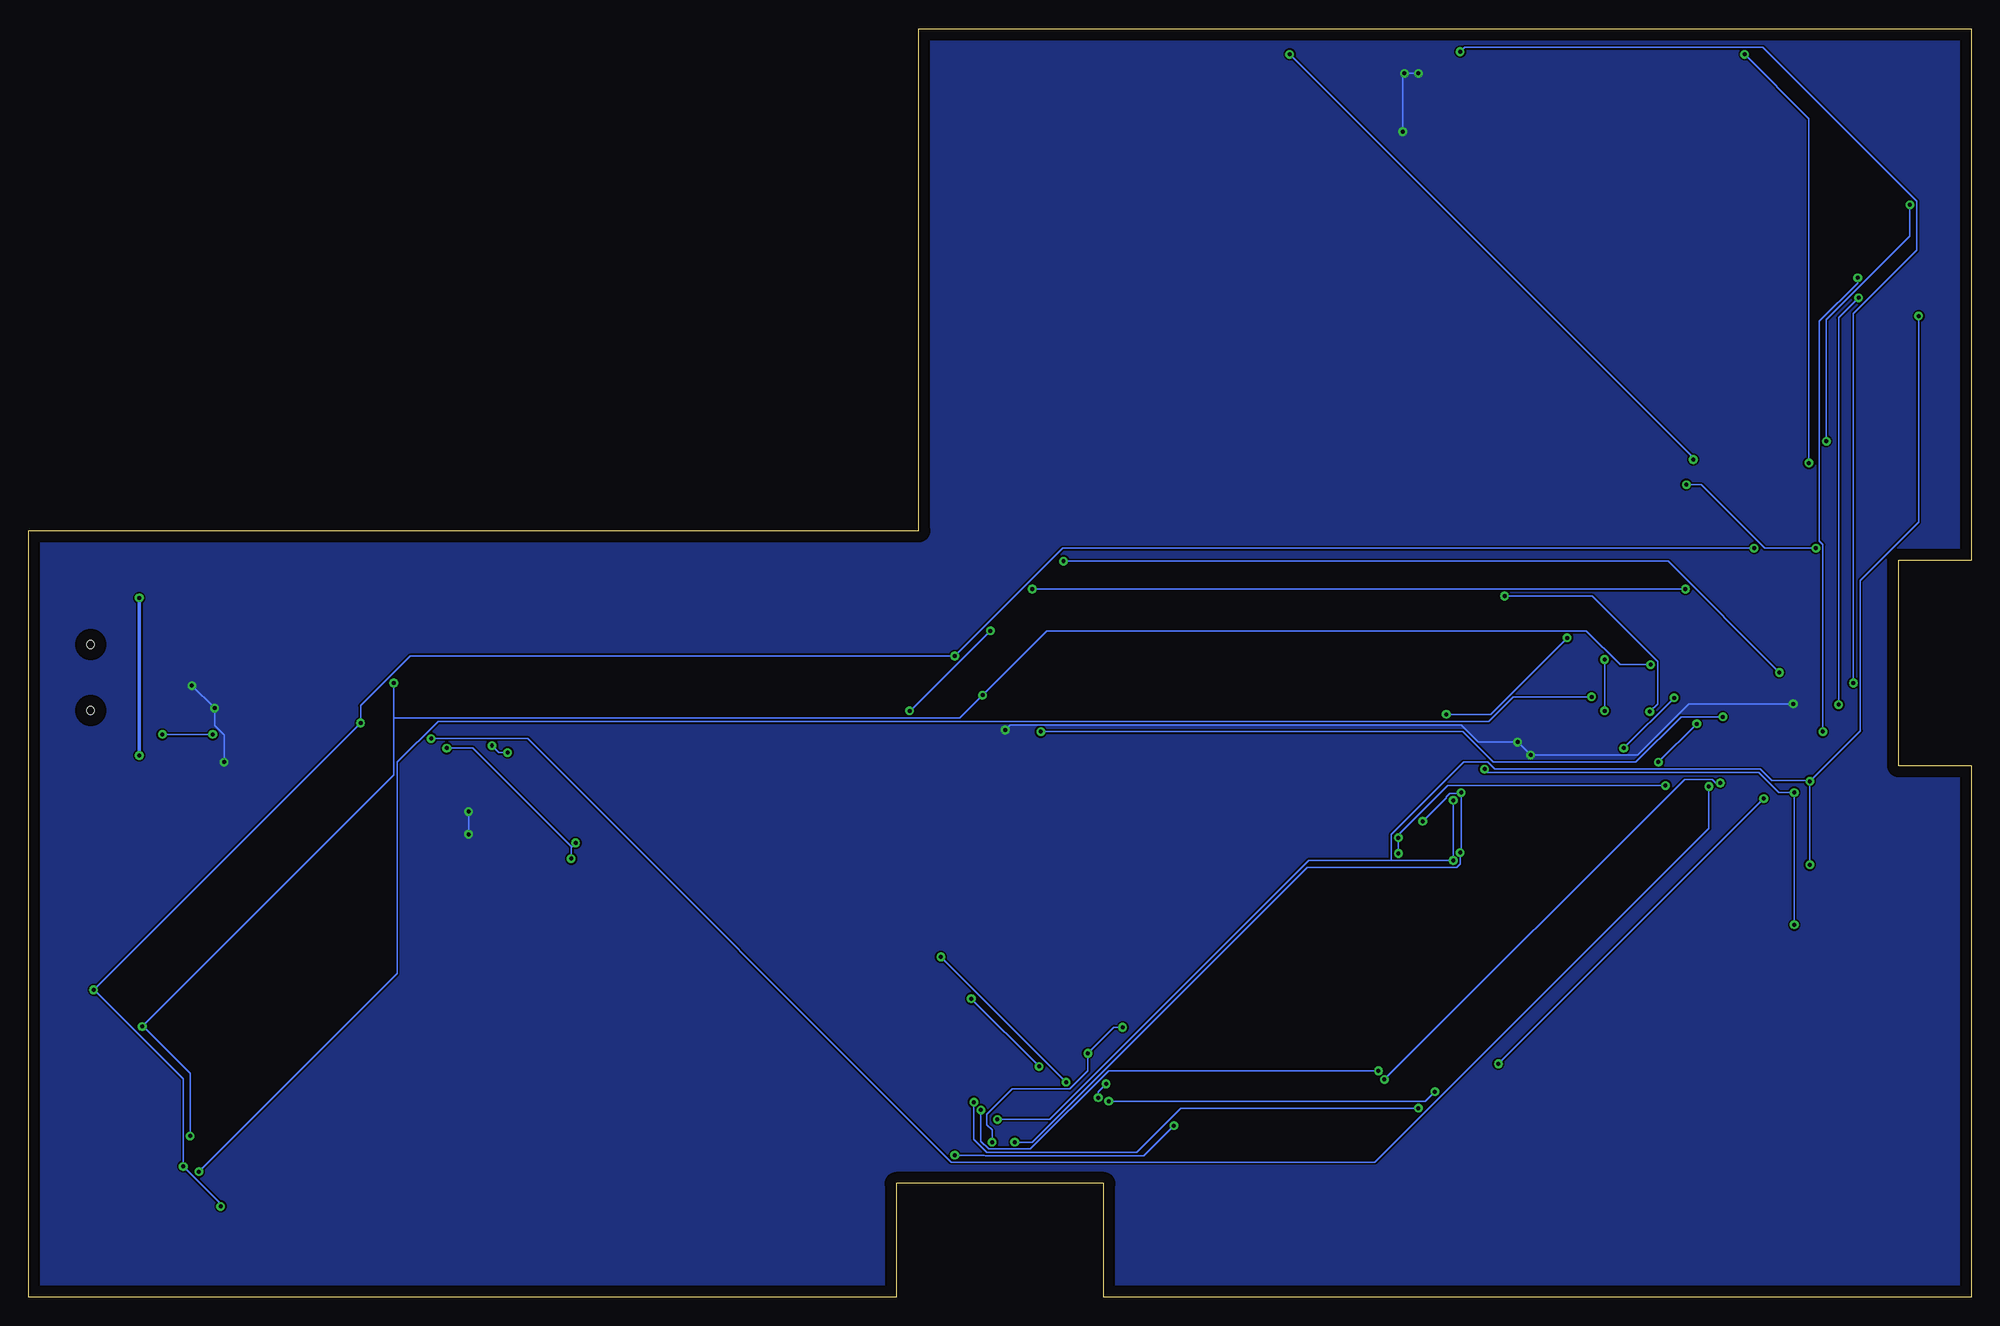
[diagram p7: board, bottom side, seen from below]

Size 170.2 x 111.2 mm. Coordinates in mm from the lower left corner, seen from the top.
Outline: 0,0 76,0 76,10 94.2,10 94.2,0 170.2,0 170.2,67.2 92.2,67.2 92.2,111.2 0,111.2 0,64.6 6.4,64.6 6.4,46.6 0,46.6 0,0
Copper layers (1*16): Top 0.035mm / dielectric 1.5mm / Bottom 0.035mm
Design rules "Fusion Electronics Design Rules": minimum track width 6mil, minimum drill 0.35mm, track to track 6mil, track to pad 6mil, pad to pad 6mil, via to via 6mil, smd to smd 6mil, copper to edge 40mil, drill to drill 6mil, minimum pad ring 10mil, minimum via ring 8mil, stop-mask expansion 4mil, vias tented up to drill 9999mil, thermal gap 10mil

### Footprints (pad centres in the part's own frame; a part is rotated, then mirrored left to right if it is on the bottom)
SON50P200X200X80-9N = smd 0.76 x 0.27: 1 -0.985,0.75; 4 -0.985,-0.75; 5 0.985,-0.75; 6 0.985,-0.25; 7 0.985,0.25; 8 0.985,0.75 | smd 0.76 x 0.326: 2 -0.985,0.25; 3 -0.985,-0.25 | smd 0.9 x 1.3: 9 0,0
ESP32_WROVER_BME680_PSON80P300X300X100-8N = smd 1.016 x 0.5: 1 1.458,1.2; 2 1.458,0.4; 3 1.458,-0.4; 4 1.458,-1.2; 5 -1.458,-1.22; 6 -1.458,-0.4; 7 -1.458,0.4; 8 -1.458,1.2
EAGLE-LTSPICE_C0402 = smd 0.7 x 0.9: 1 -0.65,0; 2 0.65,0
ESP32_WROVER_EAGLE-LTSPICE_R0402 = smd 0.7 x 0.9: 1 -0.65,0; 2 0.65,0
SOD3716X135N = smd 1.15 x 0.8: 1 -1.75,0; 2 1.75,0
IND_4828-WE-TPC_WRE = smd 0.889 x 1.778: 1 -2.286,0; 2 2.286,0
SOT65P210X110-3N = smd 1.05 x 0.5: 1 -1.05,0.65; 2 -1.05,-0.65; 3 1.05,0
FH34SRJ24S05SH99 = smd 0.3 x 0.8: 1 5.75,1.45; 2 5.25,1.45; 3 4.75,1.45; 4 4.25,1.45; 5 3.75,1.45; 6 3.25,1.45; 7 2.75,1.45; 8 2.25,1.45; 9 1.75,1.45; 10 1.25,1.45; 11 0.75,1.45; 12 0.25,1.45; 13 -0.25,1.45; 14 -0.75,1.45; 15 -1.25,1.45; 16 -1.75,1.45; 17 -2.25,1.45; 18 -2.75,1.45; 19 -3.25,1.45; 20 -3.75,1.45; 21 -4.25,1.45; 22 -4.75,1.45; 23 -5.25,1.45; 24 -5.75,1.45 | smd 0.4 x 0.8: MP1 6.75,-1.05; MP2 -6.75,-1.05
ESP32_WROVER_SPARKFUN-DISCRETESEMI_SOT23-3 = smd 0.8 x 0.9: 1 -0.95,-1; 2 0.95,-1; 3 0,1.1
SJ = smd 1.168 x 1.6: 1 -0.762,0; 2 0.762,0
XCVR_ESP32-C6-WROOM-1-N8 = smd 1.5 x 0.9: 1 -8.75,5.26; 2 -8.75,3.99; 3 -8.75,2.72; 4 -8.75,1.45; 5 -8.75,0.18; 6 -8.75,-1.09; 7 -8.75,-2.36; 8 -8.75,-3.63; 9 -8.75,-4.9; 10 -8.75,-6.17; 11 -8.75,-7.44; 12 -8.75,-8.71; 13 -8.75,-9.98; 14 -8.75,-11.25; 15 8.75,-11.25; 16 8.75,-9.98; 17 8.75,-8.71; 18 8.75,-7.44; 19 8.75,-6.17; 20 8.75,-4.9; 21 8.75,-3.63; 22 8.75,-2.36; 23 8.75,-1.09; 24 8.75,0.18; 25 8.75,1.45; 26 8.75,2.72; 27 8.75,3.99; 28 8.75,5.26 | smd 0.8 x 0.8: 29_1 -2.755,0.79; 29_2 -1.505,0.79; 29_3 -0.255,0.79; 29_4 -2.755,-0.46; 29_5 -1.505,-0.46; 29_6 -0.255,-0.46; 29_7 -2.755,-1.71; 29_8 -1.505,-1.71; 29_9 -0.255,-1.71
SON127P600X800X80-9N = smd 0.94 x 0.44: 1 -3.895,1.905; 2 -3.895,0.635; 3 -3.895,-0.635; 4 -3.895,-1.905; 5 3.895,-1.905; 6 3.895,-0.635; 7 3.895,0.635; 8 3.895,1.905 | smd 3.4 x 4.3: 9 0,0
ADAFRUIT_CHIP-LED0603 = smd 0.8 x 0.8: A 0,-0.75; C 0,0.75
ESP32_WROVER_SPARKFUN-IC-POWER_SOT23-5 = smd 0.55 x 1.2: 1 -0.95,-1.3; 2 0,-1.3; 3 0.95,-1.3; 4 0.95,1.3; 5 -0.95,1.3
JST04_1MM_RA = smd 0.6 x 1.35: 1 -1.5,0; 2 -0.5,0; 3 0.5,0; 4 1.5,0 | smd 1.2 x 2: NC1 2.8,-3.675; NC2 -2.8,-3.675
CAPCP3225X100N = smd 1.4 x 1.4: 1 -1.1,0; 2 1.1,0
SOIC127P1032X265-16N = smd 2.05 x 0.59: 1 -4.655,4.445; 2 -4.655,3.175; 3 -4.655,1.905; 4 -4.655,0.635; 5 -4.655,-0.635; 6 -4.655,-1.905; 7 -4.655,-3.175; 8 -4.655,-4.445; 9 4.655,-4.445; 10 4.655,-3.175; 11 4.655,-1.905; 12 4.655,-0.635; 13 4.655,0.635; 14 4.655,1.905; 15 4.655,3.175; 16 4.655,4.445
ESP32_WROVER_AVX---SD0805S020S1R0_AVX_SD0805S020S1R0_0 = smd 0.8 x 0.9: 1 -1.05,0; 2 1.05,0
112ATAARR03ATTEND = smd 1.8 x 1.2: G1 10.6,10.4; G2 4.9,10.4; S1 7.75,10.4; S2 2.05,10.4 | smd 1.4 x 1.9: G3 13.6,-3.85; G4 0.45,-2.85 | smd 0.7 x 1.5: P1 8.8,0; P2 7.7,0.4; P3 6.6,0; P4 5.5,-0.2; P5 4.4,0; P6 3.3,-0.2; P7 2.2,0; P8 1.1,0
DIOC1608X36N = smd 0.97 x 0.94: 1 -0.75,0; 2 0.75,0
TP20R = smd 2 x 2: TP 0,0
SAMACSYS_PARTS_USB4110GFA = smd 0.3 x 1.15: A1 -3.35,3.678; A4 -2.55,3.678; A5 -1.25,3.678; A6 -0.25,3.678; A7 0.25,3.678; A8 1.25,3.678; A9 2.55,3.678; A12 3.35,3.678; B1 3.05,3.678; B4 2.25,3.678; B5 1.75,3.678; B6 0.75,3.678; B7 -0.75,3.678; B8 -1.75,3.678; B9 -2.25,3.678; B12 -3.05,3.678 | smd 2.18 x 2: MP1 -5.11,-0.827; MP2 5.11,-0.827; MP3 -5.11,3.103; MP4 5.11,3.103 | hole 0.65: -2.89,2.603; 2.89,2.603
SOT95P280X145-6N = smd 1.2 x 0.6: 1 -1.25,0.95; 2 -1.25,0; 3 -1.25,-0.95; 4 1.25,-0.95; 5 1.25,0; 6 1.25,0.95
ESP32C6_VARISTOR_CT/CN1812 = smd 1.5 x 3.6: 1 -2.25,0; 2 2.25,0
RCL_CT3528 = smd 2 x 2.2: + -1.5,0; - 1.5,0
SOT95P280X125-5N = smd 0.9 x 0.6: 1 -1.4,0.95; 2 -1.4,0; 3 -1.4,-0.95; 4 1.4,-0.95; 5 1.4,0.95
MYBUTTON = smd 1.4 x 1.05: 1 1.75,0.75; 2 -1.75,0.75; 3 -1.75,-0.75; 4 1.75,-0.75

### Placement (x,y rotation side)
BCL_MAX17048G+T10  136.26,53.15 0 top
ENVSENS_BME680  154.77,10.85 90 top
ENVSENS_C_1  154.17,6.17 270 top
ENVSENS_C_2  152.87,6.14 270 top
ENVSENS_R_PINH_1  156.75,6.13 90 top
ENVSENS_R_PINH_2  155.45,6.16 90 top
EPDC_C_1  96.83,30.4 270 top
EPDC_C_2  81.81,24.23 0 top
EPDC_D_1  82.69,33.25 0 top
EPDC_D_2  93.57,29.85 180 top
EPDC_D_3  93.57,26.25 0 top
EPDC_L  82.64,28.82 180 top
EPDC_Q  70.88,17.53 90 top
EPDC_R_1  73.89,16.19 180 top
EPDC_R_2  69.79,14.09 180 top
EPDH_C_1  91.22,21.6 270 top
EPDH_C_2  89.37,21.64 270 top
EPDH_C_3  87.71,21.66 270 top
EPDH_C_4  85.98,21.61 270 top
EPDH_C_5  84.25,21.63 270 top
EPDH_C_6  82.48,21.65 270 top
EPDH_C_7  80.76,21.6 270 top
EPDH_C_8  79.03,21.63 270 top
EPDH_C_9  74.83,18.78 270 top
EPDH_C_10  73.7,18.79 270 top
EPDH_HEADER  85.11,13.17 0 top
EPDPOW_Q  78.85,25.2 270 top
EPDPOW_R_CL_1  76.2,25.23 270 top
EPDTS_R  71.88,13.12 270 top
EPDTS_SJ  69.58,12.37 0 top
ESP32  13.13,55.6 90 top
ESP_R  19.25,43.63 270 top
FLASH_NOR  38.28,56.25 0 top
LPBCC_C_BAT_1  120.86,51.11 180 top
LPBCC_C_BAT_2  131.11,53.16 270 top
LPBCC_CHG_LED  124.05,51.07 270 top
LPBCC_MCP73831  127.8,50.15 90 top
LPBCC_R_BAT_1  126.39,46.51 270 top
LPBCC_R_BAT_2  123.99,49.21 0 top
QWIIC  164.51,19.33 90 top
RTC_C  85.9,48.47 180 top
RTC_C_SUPERCAP  94.63,51.51 270 top
RTC_COUNTER  84.66,55.82 270 top
RTC_D  87.04,64.2 0 top
RTC_R_CAPACITOR  92.02,51.44 90 top
RTC_R_PINH1_1  87.02,62.78 0 top
RTC_R_PINH1_2  92.4,61.12 90 top
SDC_C  7.65,100.95 270 top
SDC_SDC  5.82,95.97 270 top
SPIESD_D_1  49.12,41.54 270 top
SPIESD_D_2  47.04,41.59 270 top
SPIESD_D_3  43.64,41.64 270 top
SPIESD_D_4  34.88,50.36 90 top
SPIESD_D_5  76.31,22.42 0 top
SPIESD_D_6  11.94,99.26 180 top
SPIESD_R_1  49.15,38.24 270 top
SPIESD_R_2  47.07,38.24 270 top
SPIESD_R_3  43.65,38.19 270 top
SPIESD_R_4  33.17,50.39 270 top
SPIESD_R_5  74.35,25.26 90 top
SPIESD_R_6  9.23,100.96 90 top
TP1  22.35,72.61 0 top
TP2  25.77,72.61 0 top
TP3  148.59,64.01 0 top
TP4  79.01,100.51 0 top
TP5  85.63,100.51 0 top
TP6  11.75,31.21 0 top
TP7  16.07,31.21 0 top
TP8  7.39,31.21 0 top
TP9  45.91,19.11 0 top
TP10  53.32,19.03 0 top
TP11  42.33,19.11 0 top
TP12  49.77,19.13 0 top
TP13  49.82,22.53 0 top
TP14  148.57,60.73 0 top
TP15  80.62,65.63 0 top
TP16  72.27,100.53 0 top
TP17  45.88,22.51 0 top
USBC_C_USB_1  156.83,52.34 90 top
USBC_C_USB_2  154.62,47.53 180 top
USBC_R_USB_1  154.64,46.35 0 top
USBC_R_USB_2  148.95,50.32 270 top
USBC_USB  167.36,54.33 90 top
USBC_USBLC6-2SC6Y  153.98,50.25 0 top
USBC_VARISTOR  153.13,43.55 180 top
VOLREG_C_BAT_1  121.06,38.17 180 top
VOLREG_C_BAT_2  132.63,40.64 270 top
VOLREG_C_SUPER  129.54,39.8 270 top
VOLREG_D  120.48,40.94 270 top
VOLREG_MOSFET  133.61,48.41 0 top
VOLREG_R  118.82,40.94 90 top
VOLREG_XC6220A331MR-G  124.71,40.91 0 top
VOLSPV_BD5229G-TR  49.04,102.09 0 top
VOLSPV_BOOT_BUTTON  63.99,108.91 180 top
VOLSPV_C_5  45.79,108.92 270 top
VOLSPV_C_6  67.25,108.88 270 top
VOLSPV_C_7  20.82,108.92 270 top
VOLSPV_C_DELAY  51.96,102.07 270 top
VOLSPV_CHANGE_BUTTON  23.99,108.91 180 top
VOLSPV_R_BOOT  60.7,108.88 270 top
VOLSPV_R_CHANGE  27.18,108.93 270 top
VOLSPV_R_RESET  52.26,108.88 270 top
VOLSPV_RESET_BUTTON  49.05,108.91 180 top

### Tracks (layer width: path | path; a pad name or v marks a point on that pad's centre or on a via)
3V3
  Top 0.3: TP16.TP 72.22,100.56 68.18,100.56 60.64,108.1 VOLSPV_R_BOOT.2 60.64,108.25 52.41,108.25 VOLSPV_R_RESET.2 52.26,108.18 52.26,106.43 47.99,102.16 47.69,102.16 VOLSPV_BD5229G-TR.2 47.53,102.16 40.22,102.16 | 27.11,107.87 27.11,108.25 VOLSPV_R_CHANGE.2 | 27.11,107.87 20.94,101.7 9.36,101.7 SPIESD_R_6.2 9.2,101.62 7.68,101.62 SDC_C.1 7.53,101.55 6.84,100.86 6.84,99.87 6.92,99.8 6.92,91.11 6.31,90.5 5.62,90.5 SDC_SDC.P4 | 40.22,102.16 32.83,102.16 27.11,107.87 | QWIIC.2 164.5,18.87 155.05,18.87 132.72,41.2 VOLREG_C_BAT_2.1 132.57,41.27 129.68,41.27 VOLREG_C_SUPER.+ 129.52,41.35 129.07,41.81 126.17,41.81 VOLREG_XC6220A331MR-G.5 126.1,41.73 126.1,41.5 123.73,39.14 115.05,39.14 92.49,61.7 RTC_R_PINH1_2.2 92.34,61.77 89.52,61.77 88.45,62.84 87.84,62.84 RTC_R_PINH1_1.2 | ESP32.2 9.2,46.84 9.2,46.38 12.56,43.03 19.19,43.03 ESP_R.2 19.34,43.03 22.23,43.03 28.94,49.73 33.13,49.73 SPIESD_R_4.2 33.13,49.58 33.13,48.06 43.57,37.62 SPIESD_R_3.2 43.72,37.54 47,37.54 SPIESD_R_2.2 47.08,37.46 47.08,23.37 49.29,21.16 50.35,21.16 51.19,22 51.19,37.54 | 40.22,58.72 41.59,58.72 42.12,58.19 FLASH_NOR.8 42.2,58.04 42.2,56.9 FLASH_NOR.7 42.35,56.9 76.34,56.9 80.91,52.32 | 40.22,58.72 36.41,58.72 36.26,58.57 36.26,57.66 34.43,55.83 34.43,55.68 FLASH_NOR.3 | RTC_R_PINH1_1.2 87.69,62.84 87.69,63.75 88.07,64.13 RTC_D.2 | RTC_R_PINH1_1.2 87.84,62.69 87.84,60.48 RTC_COUNTER.2 87.84,60.32 87.84,59.26 80.91,52.32 | 51.19,37.54 62.62,37.54 74.2,25.96 SPIESD_R_5.2 74.36,25.88 75.65,24.59 76.19,24.59 EPDPOW_R_CL_1.2 76.34,24.59 76.95,25.2 79.92,25.2 EPDPOW_Q.3 79.54,25.27 79.54,33.27 80.83,34.57 80.83,52.25 80.91,52.32
  Top 0.3: 51.19,37.54 49.21,37.54 SPIESD_R_1.2 | 40.22,58.72 40.22,102.16
32KHZ  (via drill 0.35)
  Top 0.152: RTC_R_PINH1_2.1 92.34,60.48 89.14,60.48 RTC_COUNTER.1 89.06,60.4 89.06,59.87 82.2,53.01 82.2,50.27 v81.52,49.58 | v21.78,50.88 18.04,47.14 18.04,46.91 ESP32.9
  Bottom 0.152: v21.78,50.88 25.43,50.88 29.4,46.91 41.89,46.91 44.56,49.58 v81.52,49.58
DN  (via drill 0.35)
  Top 0.152: USBC_USB.A7 163.74,54.53 164.35,54.53 164.5,54.38 164.5,53.85 164.27,53.62 163.74,53.62 USBC_USB.B7 163.66,53.54 163.05,53.54 158.86,49.35 v158.48,49.35 | v154.06,49.35 155.2,49.35 USBC_USBLC6-2SC6Y.4
  Bottom 0.152: v158.48,49.35 v154.06,49.35
DP
  Top 0.152: 162.86,54.88 163.05,55.07 163.66,55.07 USBC_USB.B6 | 162.86,54.88 162.82,54.84 162.82,54.38 163.05,54.15 163.66,54.15 USBC_USB.A6 | 162.86,54.88 155.74,62 148.04,62 147.28,61.24 147.28,60.25 155.2,52.32 155.2,51.26 USBC_USBLC6-2SC6Y.6
EPD_3V3
  Top 0.3: EPDH_HEADER.16 83.42,14.6 83.8,14.6 EPDH_HEADER.15 83.88,14.76 83.88,15.14 87.69,18.95 87.69,21.01 EPDH_C_3.2 87.61,21.08 86.78,21.92 86.78,22.76 86.09,23.44 81.9,23.44 81.21,24.13 EPDC_C_2.1 81.14,24.28 80.76,24.28 | 80.76,24.28 77.86,24.28 EPDPOW_Q.2 77.71,24.21 77.4,23.9 75.65,23.9 72.45,20.7 49.06,20.7 47.3,22.45 45.93,22.45 TP17.TP | 80.76,24.28 80.76,25.73 80.38,26.11 80.38,28.78 EPDC_L.2
EPD_3V3_C
  Top 0.3: EPDPOW_Q.1 77.78,26.11 77.56,25.88 76.26,25.88 EPDPOW_R_CL_1.1 76.11,25.96 75.57,25.96 61.93,39.6 48.52,39.6 48.07,39.14 | 48.07,39.14 48.37,38.84 48.37,24.05 49.82,22.61 TP13.TP | 48.07,39.14 47.61,39.6 46.85,39.6 46.24,40.21 46.24,41.2 35.49,51.94 32.6,51.94 20.63,63.91 20.63,64.29 ESP32.18
EPD_BUSY  (via drill 0.35)
  Top 0.152: v75.57,17.2 79.77,13 86.09,13 86.85,13.77 86.85,14.6 EPDH_HEADER.9 | v47,18.03 45.93,19.1 TP9.TP 45.86,19.18 27.42,37.62 v27.42,46.91 | v24.06,50.27 10.42,63.91 10.42,64.29 ESP32.26
  Bottom 0.152: v75.57,17.2 47.84,17.2 v47,18.03 | v27.42,46.91 v24.06,50.27
EPD_CS  (via drill 0.35)
  Top 0.152: v85.79,13.61 85.41,14 85.41,14.6 EPDH_HEADER.12 | SPIESD_D_5.2 77.1,22.38 77.4,22.07 v77.4,21.39 73.75,21.39 71.76,19.41 53.63,19.41 53.32,19.1 TP10.TP 53.25,19.1 v51.42,19.1 | v74.36,23.67 74.36,24.59 SPIESD_R_5.1 | v22.01,45.08 20.63,46.46 20.63,46.84 ESP32.11
  Bottom 0.152: v85.79,13.61 85.79,14.68 86.24,15.14 86.24,16.05 84.03,18.26 79,18.26 77.4,19.86 v77.4,21.39 75.12,23.67 v74.36,23.67 | v22.01,45.08 22.39,45.08 22.69,45.39 25.13,45.39 v51.42,19.1
EPD_DC  (via drill 0.35)
  Top 0.152: v87.39,17.12 86.55,17.12 86.09,16.66 86.09,15.44 85.86,15.21 85.86,14.68 EPDH_HEADER.11 | v48.45,16.59 44.87,16.59 42.35,19.1 TP11.TP 42.28,19.18 41.44,20.02 v41.44,20.47 | v18.2,43.71 18.12,43.64 14.84,43.64 13.02,45.47 13.02,46.84 ESP32.5
  Bottom 0.152: v87.39,17.12 87.39,13.84 86.24,12.7 73.14,12.7 69.25,16.59 v48.45,16.59 | v41.44,20.47 v18.2,43.71
EPD_RST  (via drill 0.35)
  Top 0.152: v86.78,16.43 86.39,16.05 86.39,14.68 EPDH_HEADER.10 | v51.95,19.86 50.5,19.86 49.82,19.18 TP12.TP 49.74,19.18 48.68,20.24 46.39,20.24 30.46,36.17 v30.46,48.13 | v26.04,52.55 16.82,61.77 16.82,64.29 ESP32.21
  Bottom 0.152: v86.78,16.43 86.78,13.69 86.09,13 82.43,13 75.57,19.86 v51.95,19.86 | v30.46,48.13 v26.04,52.55
FLASH_CS  (via drill 0.35)
  Top 0.152: SPIESD_D_4.2 34.81,51.1 33.21,51.1 SPIESD_R_4.1 33.13,51.1 32.83,51.41 v32.14,51.41 31.61,51.94 26.65,51.94 21.85,47.14 21.85,46.91 ESP32.12 | v32.14,55.91 34.35,58.12 FLASH_NOR.1
  Bottom 0.152: v32.14,51.41 v32.14,55.91
GDR  (via drill 0.35)
  Top 0.152: v89.06,12.47 90.36,13.77 90.36,14.6 EPDH_HEADER.2 | EPDC_R_2.2 69.17,14.15 69.86,14.83 v69.86,15.06 70.16,15.37 70.16,16.43 EPDC_Q.1
  Bottom 0.152: v89.06,12.47 86.47,12.47 86.39,12.4 72.53,12.4 v69.86,15.06
GND  (via drill 0.35)
  Top 0.152: VOLSPV_BOOT_BUTTON.1 62.24,108.18 65.67,108.18 VOLSPV_BOOT_BUTTON.2 65.74,108.18 67.19,108.18 VOLSPV_C_6.2 67.27,108.18 71.38,108.18 76.53,103.03 | TP5.TP 85.56,100.56 79.08,100.56 TP4.TP 79,100.56 76.53,103.03 | 49.86,101.66 49.9,101.7 51.72,101.7 51.95,101.47 VOLSPV_C_DELAY.2 52.03,101.4 54.16,99.26 72.76,99.26 76.53,103.03 | 49.86,101.66 49.36,101.17 47.69,101.17 VOLSPV_BD5229G-TR.3 | v49.67,107.26 50.5,108.1 50.73,108.1 VOLSPV_RESET_BUTTON.2 | v48.45,107.26 48.14,107.26 47.3,108.1 VOLSPV_RESET_BUTTON.1 47.23,108.18 47.15,108.25 45.86,108.25 VOLSPV_C_5.2 45.78,108.33 44.71,108.33 44.18,108.86 26.5,108.86 25.82,108.18 VOLSPV_CHANGE_BUTTON.2 25.66,108.18 22.31,108.18 VOLSPV_CHANGE_BUTTON.1 22.23,108.18 22.16,108.25 20.86,108.25 VOLSPV_C_7.2 20.79,108.25 13.17,108.25 3.03,98.12 3.03,95.53 SDC_SDC.G4 3.03,95.45 3.03,95.07 5.39,92.71 5.55,92.71 SDC_SDC.P6 5.32,92.71 2.04,89.43 2.04,85.39 | v49.82,102.16 49.82,101.7 49.86,101.66 | 38.58,47.41 43.57,42.42 SPIESD_D_3.1 | 38.58,47.41 36.41,49.58 34.88,49.58 SPIESD_D_4.1 | SPIESD_D_1.1 49.06,42.34 47.08,42.34 SPIESD_D_2.1 47,42.34 45.7,42.34 39.57,48.48 | 36.45,54.42 38.24,56.21 FLASH_NOR.9 | 36.45,54.42 36.41,54.38 34.43,54.38 FLASH_NOR.4 | 39.57,48.48 36.48,51.56 36.48,54.38 36.45,54.42 | v38.62,47.52 38.62,47.45 38.58,47.41 | 39.57,48.48 v39.76,48.67 | 12.33,54.46 12.33,55.3 ESP32.29_3 | 12.33,54.46 12.33,54.15 ESP32.29_2 | ESP32.29_5 13.62,54.15 13.62,55.3 ESP32.29_6 13.7,55.3 14.77,55.3 ESP32.29_9 | ESP32.29_8 14.77,54.15 13.7,54.15 ESP32.29_5 | ESP32.29_2 12.41,54.15 13.55,54.15 ESP32.29_5
  Top 0.152: 10,54.42 10.04,54.46 12.33,54.46 | 10,54.42 7.91,52.32 7.91,46.91 ESP32.1 | 12.33,54.46 ESP32.29_2 | 10,54.42 7.91,56.51 7.91,64.29 ESP32.28 7.83,64.36 7.83,76.56 2.04,82.35 SDC_SDC.G3 2.04,82.42 2.04,85.39 | ESP32.29_2 12.41,54.08 12.41,52.93 ESP32.29_1 12.41,52.86 13.55,52.86 ESP32.29_4 13.62,52.86 14.77,52.86 ESP32.29_7 14.84,52.78 v15.61,52.02 | SDC_C.2 7.68,100.33 8.06,100.33 8.67,100.94 10.96,100.94 12.63,99.26 SPIESD_D_6.1 12.71,99.19 12.71,94.61 16.21,91.11 SDC_SDC.G2 16.29,91.03 17.05,90.27 17.05,87.22 16.29,86.46 16.29,85.39 SDC_SDC.G1 16.21,85.39 2.04,85.39 | EPDTS_R.1 71.84,13.84 70.7,13.84 70.47,14.07 EPDC_R_2.1 | EPDC_R_2.1 70.39,14.07 69.78,13.46 69.71,13.46 68.87,12.62 68.87,12.4 EPDTS_SJ.1 68.87,12.32 68.87,12.09 69.63,11.33 71.92,11.33 72.68,12.09 78.32,12.09 EPDH_HEADER.MP2 78.39,12.09 88.53,12.09 88.76,11.86 91.58,11.86 91.81,12.09 EPDH_HEADER.MP1 91.88,12.17 91.88,20.47 91.96,20.55 91.96,21.54 91.27,22.22 EPDH_C_1.1 91.2,22.22 89.44,22.22 EPDH_C_2.1 89.37,22.22 88.99,22.22 88.41,21.65 | EPDH_HEADER.17 82.89,14.68 82.89,16.74 86.7,20.55 86.7,21.39 86.01,22.07 86.01,22.22 EPDH_C_4.1 85.94,22.3 84.26,22.3 EPDH_C_5.1 84.19,22.3 82.51,22.3 EPDH_C_6.1 82.43,22.22 80.83,22.22 EPDH_C_7.1 80.76,22.3 79.08,22.3 EPDH_C_8.1 | SPIESD_D_5.1 75.57,22.45 75.8,22.45 76.49,23.14 78.17,23.14 79,22.3 EPDH_C_8.1 | EPDH_C_8.1 79,22.22 78.32,21.54 78.32,21.39 76.41,19.48 74.89,19.48 EPDH_C_9.1 74.81,19.48 73.75,19.48 EPDH_C_10.1 73.67,19.41 73.29,19.41 71,17.12 71,16.13 70.47,15.59 70.47,14.15 EPDC_R_2.1 | 131.66,39.98 131.28,39.98 129.6,38.3 VOLREG_C_SUPER.- 129.52,38.23 128.76,37.46 121.14,37.46 120.46,38.15 VOLREG_C_BAT_1.2 120.38,38.23 106.82,38.23 94.7,50.34 RTC_C_SUPERCAP.2 94.62,50.34 92.72,50.34 90.13,47.75 86.09,47.75 86.05,47.79
  Top 0.152: 131.66,39.98 132.57,39.98 VOLREG_C_BAT_2.2 | 85.25,49.73 85.25,51.1 RTC_COUNTER.13 | 85.25,49.73 85.25,48.51 RTC_C.2 85.33,48.51 86.05,47.79 | 88.41,21.65 87.77,22.3 EPDH_C_3.1 87.77,22.38 85.94,24.21 82.51,24.21 EPDC_C_2.2 82.43,24.28 82.43,31.29 80.98,32.74 80.98,33.2 EPDC_D_1.1 80.98,33.27 86.01,38.3 86.01,47.75 86.05,47.79 | 88.41,21.65 88.45,21.62 88.45,17.27 87.39,16.2 87.39,14.68 EPDH_HEADER.8 | VOLREG_R.1 118.78,40.36 118.09,41.05 118.09,49.05 120.15,51.1 LPBCC_C_BAT_1.2 120.23,51.18 120.46,51.18 121.45,52.17 126.78,52.17 128.76,50.19 129.07,50.19 LPBCC_MCP73831.2 129.14,50.19 129.45,50.19 130.55,51.3 | v155.89,53.62 156.5,53.01 156.8,53.01 USBC_C_USB_1.2 | v153.91,51.64 153.91,51.1 153.07,50.27 152.77,50.27 USBC_USBLC6-2SC6Y.2 152.69,50.19 152.38,50.19 151.93,49.73 148.96,49.73 USBC_R_USB_2.2 148.88,49.73 140.8,49.73 137.68,52.86 137.3,52.86 BCL_MAX17048G+T10.6 137.22,52.93 136.53,52.93 136.38,53.09 BCL_MAX17048G+T10.9 | BCL_MAX17048G+T10.9 136.31,53.09 135.7,52.48 135.32,52.48 BCL_MAX17048G+T10.4 135.24,52.4 135.24,50.19 134.25,49.2 134.25,48.97 134.1,48.82 133.03,48.82 130.55,51.3 | BCL_MAX17048G+T10.1 135.32,53.85 135.7,53.85 136.38,53.16 BCL_MAX17048G+T10.9 | 130.55,51.3 131.05,51.79 131.05,52.48 LPBCC_C_BAT_2.2 | ENVSENS_C_1.2 154.14,5.46 152.92,5.46 ENVSENS_C_2.2 152.84,5.54 152.54,5.54 151.85,6.22 151.85,7.37 153.19,8.7 | ENVSENS_BME680.5 155.97,9.42 155.97,9.65 155.43,10.19 154.9,10.19 154.44,9.73 154.44,9.42 ENVSENS_BME680.7 154.37,9.35 154.37,9.12 153.83,8.59 153.3,8.59 153.19,8.7 | 153.19,8.7 153.07,8.81 153.07,10.34 153.53,10.79 153.53,12.24 ENVSENS_BME680.1 153.6,12.32 153.6,12.62 158.78,17.8 164.5,17.8 QWIIC.1 164.58,17.88 164.88,17.88 165.41,18.41 165.41,40.89
  Top 0.152: 124.04,42.57 124.04,48.21 123.35,48.89 123.35,49.2 LPBCC_R_BAT_2.1 | 124.04,42.57 124.04,41.5 123.5,40.97 123.35,40.97 VOLREG_XC6220A331MR-G.2 | 153.99,46.91 153.99,46.38 USBC_R_USB_1.1 153.99,43.72 151.77,41.5 | 153.99,46.91 153.99,47.52 USBC_C_USB_2.2 | 164.27,49.27 168.16,49.27 USBC_USB.MP1 168.16,49.35 168.16,59.41 USBC_USB.MP2 168.16,59.49 164.27,59.49 USBC_USB.MP4 163.68,58.87 USBC_USB.A12 USBC_USB.B1 | 164.27,49.27 USBC_USB.MP3 164.25,42.05 165.41,40.89 | 124.04,42.57 v131.66,42.57 148.96,42.57 150.02,41.5 151.77,41.5 | 153.99,46.91 v153.07,46.91 | v131.66,40.59 131.66,39.98 | 85.25,49.73 v84.64,49.73 | USBC_USB.B12 USBC_USB.A1 163.68,49.87 164.27,49.27 | 151.77,41.5 151.8,41.5 152.41,40.89 165.41,40.89
  Bottom 0.152: v48.45,107.26 v49.67,107.26 49.82,107.11 v49.82,102.16 | v15.61,52.02 24.75,52.02 29.24,47.52 v38.62,47.52 v39.76,48.67 43.19,48.67 44.71,50.19 84.19,50.19 v84.64,49.73 | v155.89,53.62 v153.91,51.64 153.91,50.11 153.07,49.27 v153.07,46.91 | v131.66,42.57 v131.66,40.59
  pour Bottom: -0.57,-8.72 209.17,-8.72 218.12,0.23 218.12,132.67 209.97,140.82 -0.37,140.82 -5.13,135.66 -5.14,135.66 -5.15,135.65 -5.15,135.64 -5.16,135.64 -9.32,131.47 -9.32,0.03
  pour Top: -0.57,-8.72 209.17,-8.72 218.12,0.23 218.12,132.67 209.97,140.82 -0.37,140.82 -9.32,131.47 -9.32,0.03
I2C_PW  (via drill 0.35)
  Top 0.152: ENVSENS_C_2.1 152.92,6.83 154.14,6.83 ENVSENS_C_1.1 154.21,6.83 154.9,6.83 155.2,7.14 ENVSENS_R_PINH_2.2 | ENVSENS_R_PINH_2.2 155.51,6.83 156.73,6.83 ENVSENS_R_PINH_1.2 | 155.2,8.59 155.2,7.21 155.51,6.91 ENVSENS_R_PINH_2.2 | 155.2,8.59 155.2,9.35 ENVSENS_BME680.6 | v33.28,52.63 21.85,64.06 21.85,64.29 ESP32.17 | v155.28,11.02 155.43,11.02 156.5,9.96 156.5,8.81 156.27,8.59 155.2,8.59
  Bottom 0.152: v33.28,52.63 40.14,52.63 42.28,50.5 134.32,50.5 137.91,46.91 137.91,28.4 v155.28,11.02
INT_RTC  (via drill 0.35)
  Top 0.152: RTC_COUNTER.3 86.55,60.48 86.39,60.63 86.39,62.76 RTC_R_PINH1_1.1 86.32,62.84 83.42,62.84 80.68,65.58 TP15.TP 80.6,65.58 v79.54,64.52 | v16.82,54.76 16.82,46.91 ESP32.8
  Bottom 0.152: v16.82,54.76 26.58,64.52 v79.54,64.52
IO/BOOT  (via drill 0.35)
  Top 0.152: VOLSPV_C_6.1 67.19,109.55 65.82,109.55 65.74,109.63 VOLSPV_BOOT_BUTTON.3 65.67,109.7 62.24,109.7 VOLSPV_BOOT_BUTTON.4 62.24,109.63 62.16,109.55 60.72,109.55 VOLSPV_R_BOOT.1 60.64,109.47 60.11,108.94 v59.72,108.94 | v24.37,73.43 24.37,64.36 ESP32.15
  Bottom 0.152: v24.37,73.43 24.37,73.58 v59.72,108.94
IO/CHANGE  (via drill 0.35)
  Top 0.152: VOLSPV_R_CHANGE.1 27.11,109.63 25.74,109.63 VOLSPV_CHANGE_BUTTON.3 25.66,109.7 22.31,109.7 VOLSPV_CHANGE_BUTTON.4 22.23,109.63 20.86,109.63 VOLSPV_C_7.1 20.79,109.55 20.18,108.94 v19.87,108.94 | v14.23,73.13 14.23,64.36 ESP32.23
  Bottom 0.152: v14.23,73.13 14.23,103.3 v19.87,108.94
MISO  (via drill 0.35)
  Top 0.152: v50.2,38.91 49.21,38.91 SPIESD_R_1.1 | v50.2,40.28 49.59,40.28 49.13,40.74 SPIESD_D_1.2 49.13,40.82 49.13,40.97 49.82,41.66 49.82,47.29 v46.01,51.1 | 35.07,57.85 35.11,57.89 35.11,65.05 26.12,74.04 13.78,74.04 13.74,74 | 35.07,57.85 34.43,57.2 34.43,56.9 FLASH_NOR.2 | 13.74,74 9.2,69.47 9.2,64.36 ESP32.27 | v5.39,95.76 5.24,95.76 4.78,95.3 4.78,94.46 5.47,93.78 5.78,93.78 SDC_SDC.P7 | 13.74,74 v12.71,75.03 | v35.42,57.81 35.11,57.81 35.07,57.85 | v26.81,44.86 13.17,31.22 11.8,31.22 TP6.TP
  Bottom 0.152: v50.2,38.91 v50.2,40.28 50.2,40.51 45.86,44.86 v26.81,44.86 | v5.39,95.76 5.39,93.01 12.71,85.7 v12.71,75.03 | v46.01,51.1 42.12,51.1 v35.42,57.81
MOSI  (via drill 0.35)
  Top 0.152: v15.53,44.25 15.53,46.84 ESP32.7 15.45,46.91 15.45,47.14 v13.02,49.58 | v15.53,32.66 15.53,31.75 TP7.TP | v9.97,89.36 5.85,89.36 SDC_SDC.P3 | v83.8,13.61 84.34,14.15 84.34,14.6 EPDH_HEADER.14 | v44.79,38.99 46.92,38.99 47,38.91 SPIESD_R_2.1 | v44.71,44.25 v42.66,46.3 42.2,46.76 42.2,54.3 FLASH_NOR.5 | v48.07,41.73 47.23,40.89 47.08,40.89 SPIESD_D_2.2
  Bottom 0.152: v15.53,32.66 v15.53,44.25 16.9,44.25 18.65,46 42.35,46 v42.66,46.3 | v9.97,89.36 9.97,88.9 13.32,85.55 13.32,66.27 13.02,65.96 v13.02,49.58 | v83.8,13.61 82.28,13.61 58.2,37.69 45.09,37.69 44.79,38 v44.79,38.99 44.71,39.06 44.71,44.17 | v48.07,41.73 46.01,43.79 46.01,43.87 45.7,44.17 44.71,44.17 | 44.71,44.17 v44.71,44.25
N$1  (via drill 0.35)
  Top 0.152: v122.67,38.45 122.44,38.23 121.75,38.23 VOLREG_C_BAT_1.1 | 122.59,39.83 123.2,39.83 123.28,39.9 VOLREG_XC6220A331MR-G.3 | 122.63,41.31 122.59,41.27 122.59,39.83 | 122.63,41.31 123.12,41.81 123.28,41.81 VOLREG_XC6220A331MR-G.1 | 122.59,39.83 v122.29,39.83 | 122.63,41.31 121.98,41.96 120.53,41.96 VOLREG_D.1 | v133.56,48.13 134.25,47.45 134.55,47.45 VOLREG_MOSFET.2
  Bottom 0.152: v122.67,38.45 122.67,39.45 122.63,39.48 | v122.29,39.83 122.63,39.48 | v133.56,48.13 131.28,48.13 122.63,39.48
N$2
  Top 0.152: VOLSPV_BD5229G-TR.5 50.5,103 51.72,103 51.95,102.77 VOLSPV_C_DELAY.1
N$3  (via drill 0.35)
  Top 0.152: v128.23,47.75 126.4,45.92 LPBCC_R_BAT_1.2 | v129.6,48.36 129.6,48.74 129.14,49.2 LPBCC_MCP73831.1
  Bottom 0.152: v128.23,47.75 128.99,47.75 v129.6,48.36
N$4
  Top 0.152: LPBCC_CHG_LED.C 124.72,51.03 124.72,50.42 124.04,49.73 124.04,48.67 125.49,47.22 126.32,47.22 LPBCC_R_BAT_1.1
N$5
  Top 0.152: ESP_R.1 19.26,44.32 19.26,46.84 ESP32.10
N$6
  Top 0.152: LPBCC_R_BAT_2.2 124.65,49.27 126.48,49.27 LPBCC_MCP73831.5
N$7
  Top 0.152: USBC_R_USB_2.1 148.88,51.03 148.88,58.19 146.97,60.1 146.97,61.39 147.89,62.31 156.88,62.31 158.89,60.29 159.54,59.64 163.05,56.13 163.66,56.13 USBC_USB.B5
N$8  (via drill 0.35)
  Top 0.152: v76.49,17.5 79.31,14.68 EPDH_HEADER.24 | v75.8,18.72 74.28,18.72 73.75,18.19 EPDH_C_10.2
  Bottom 0.152: v76.49,17.5 76.49,18.03 v75.8,18.72
N$9
  Top 0.152: EPDC_C_1.1 96.76,30.99 96.45,30.99 95.39,29.92 EPDC_D_2.1 95.31,29.92 92.03,33.2 84.49,33.2 EPDC_D_1.2
N$11
  Top 0.152: EPDH_HEADER.22 80.3,14.68 80.3,19.71 79.08,20.93 EPDH_C_8.2
N$13
  Top 0.152: ENVSENS_BME680.8 153.6,9.42 153.6,10.41 154.37,11.18 154.37,12.24 ENVSENS_BME680.2
N$14  (via drill 0.35)
  Top 0.152: v85.94,58.42 86.17,58.42 87.16,59.41 87.16,61.54 87.08,61.62 87.08,63.22 86.17,64.13 86.01,64.13 RTC_D.1 | v93.02,51.41 92.64,51.41 92.03,50.8 RTC_R_CAPACITOR.1
  Bottom 0.152: v85.94,58.42 92.95,51.41 v93.02,51.41
N$15
  Top 0.152: EPDH_HEADER.20 81.37,14.68 81.37,19.02 82.43,20.09 82.43,20.93 EPDH_C_6.2
N$16
  Top 0.152: EPDH_HEADER.19 81.9,14.68 81.9,18.64 84.19,20.93 EPDH_C_5.2
N$17
  Top 0.152: USBC_R_USB_1.2 155.36,46.38 156.42,46.38 163.05,53.01 163.66,53.01 USBC_USB.A5
N$18
  Top 0.152: EPDH_HEADER.18 82.43,14.68 82.43,17.42 85.94,20.93 EPDH_C_4.2
N$20
  Top 0.152: EPDH_HEADER.5 88.91,14.68 88.91,20.47 89.37,20.93 EPDH_C_2.2
N$21
  Top 0.152: EPDH_HEADER.4 89.37,14.68 89.37,19.1 91.2,20.93 EPDH_C_1.2
PREVGH  (via drill 0.35)
  Top 0.152: 80.83,20.24 80.83,20.93 EPDH_C_7.2 | 80.83,20.24 80.83,14.68 EPDH_HEADER.21 | v87.61,26.19 91.81,26.19 EPDC_D_3.1 | 80.83,20.24 v81.67,20.24
  Bottom 0.152: v81.67,20.24 v87.61,26.19
PREVGL  (via drill 0.35)
  Top 0.152: 77.67,17.23 76.79,18.11 74.89,18.11 EPDH_C_9.2 | 77.67,17.23 79.84,15.06 79.84,14.68 EPDH_HEADER.23 | v90.28,29.84 91.81,29.84 EPDC_D_2.2 | 77.67,17.23 v79.31,18.87
  Bottom 0.152: v79.31,18.87 v90.28,29.84
RESE
  Top 0.152: EPDH_HEADER.3 89.82,14.6 89.82,14.15 88.38,12.7 79.16,12.7 74.96,16.89 73.97,16.89 73.29,16.2 EPDC_R_1.2 73.21,16.2 72.98,16.43 71.54,16.43 EPDC_Q.2
RESE'
  Top 0.152: EPDTS_SJ.2 70.39,12.4 71.84,12.4 EPDTS_R.2 71.92,12.47 74.51,15.06 74.51,16.13 EPDC_R_1.1
RESET  (via drill 0.35)
  Top 0.152: 49.09,108.06 50.73,109.7 VOLSPV_RESET_BUTTON.3 50.81,109.63 50.89,109.55 52.26,109.55 VOLSPV_R_RESET.1 | 49.09,108.06 49.06,108.03 49.06,106.96 47.69,105.59 47.69,103.07 VOLSPV_BD5229G-TR.1 | v10.35,53.85 10.35,46.91 ESP32.3 | v44.79,109.17 45.4,109.17 45.78,109.55 VOLSPV_C_5.1 45.86,109.63 47.23,109.63 VOLSPV_RESET_BUTTON.4 47.3,109.63 47.53,109.63 49.09,108.06
  Bottom 0.152: v10.35,53.85 10.35,86.23 4.78,91.8 4.78,96.06 18.27,109.55 44.41,109.55 v44.79,109.17
RTC_RST  (via drill 0.35)
  Top 0.152: v25.05,62.08 23.15,63.98 23.15,64.29 ESP32.16 | v82.28,62.08 84.03,62.08 85.25,60.86 85.25,60.48 RTC_COUNTER.4
  Bottom 0.152: v82.28,62.08 v25.05,62.08
RX  (via drill 0.35)
  Top 0.152: v13.62,65.66 13.02,65.05 13.02,64.36 ESP32.24 | v24.98,71.22 24.98,71.83 25.74,72.59 TP2.TP
  Bottom 0.152: v13.62,65.66 18.12,65.66 23.68,71.22 v24.98,71.22
SCK  (via drill 0.35)
  Top 0.152: v14.16,45.24 14.16,46.84 ESP32.6 | v14.16,37.92 7.45,31.22 TP8.TP | v4.63,86 4.63,90.96 5.24,91.57 5.78,91.57 SDC_SDC.P5 | v85.33,15.59 84.87,15.14 84.87,14.68 EPDH_HEADER.13 | v45.4,38.3 44.26,38.3 43.72,38.84 SPIESD_R_3.1 43.65,38.91 43.65,40.82 SPIESD_D_3.2 | v45.4,43.56 45.4,52.17 42.2,55.37 42.2,55.6 FLASH_NOR.6
  Bottom 0.152: v14.16,37.92 v14.16,45.24 | v4.63,86 4.63,67.94 9.74,62.84 9.74,49.66 v14.16,45.24 | v85.33,15.59 80.76,15.59 58.05,38.3 50.81,38.3 | 50.81,38.3 v45.4,38.3 v45.4,43.56 | 50.81,38.3 50.81,40.59 44.48,46.91 42.35,46.91 41.74,46.3 18.5,46.3 17.51,45.31 14.16,45.31 v14.16,45.24
SCL  (via drill 0.35)
  Top 0.152: v153.38,7.98 152.92,7.98 152.16,7.21 152.16,6.38 152.38,6.15 155.97,6.15 156.58,5.54 156.73,5.54 ENVSENS_R_PINH_1.1 | v156.65,11.48 156.65,11.63 156.04,12.24 ENVSENS_BME680.4 | v141.11,50.34 140.8,50.34 137.75,53.39 137.3,53.39 BCL_MAX17048G+T10.7 | v164.5,26.95 164.5,20.85 QWIIC.4 | v19.03,65.66 18.04,64.67 18.04,64.36 ESP32.20 | v89.06,56.21 89.06,51.18 RTC_COUNTER.16
  Bottom 0.152: v153.38,7.98 153.38,8.2 v156.65,11.48 156.65,19.18 164.42,26.95 v164.5,26.95 v141.11,50.34 141.11,51.87 136.76,56.21 v89.06,56.21 79.61,65.66 v19.03,65.66
SDA  (via drill 0.35)
  Top 0.152: ENVSENS_R_PINH_2.1 155.51,5.46 156.12,4.85 157.26,4.85 157.49,5.08 157.49,9.73 155.2,12.01 155.2,12.24 ENVSENS_BME680.3 155.2,12.32 155.2,13.31 v156.04,14.15 | v138.21,53.85 137.3,53.85 BCL_MAX17048G+T10.8 | v160.23,23.75 164.12,19.86 164.5,19.86 QWIIC.3 | v28.1,55.45 27.87,55.45 19.34,63.98 19.34,64.29 ESP32.19 | v86.62,52.78 87.77,51.64 87.77,51.18 RTC_COUNTER.15
  Bottom 0.152: 138.21,50.8 138.21,45.77 v160.23,23.75 160.16,23.75 156.04,19.63 v156.04,14.15 | 138.21,50.8 v138.21,53.85 | v28.1,55.45 30.77,55.45 33.74,58.42 80.98,58.42 v86.62,52.78 88.6,50.8 138.21,50.8
SRC
  Top 0.152: EPDC_C_1.2 96.76,29.69 96.76,27.64 95.39,26.26 EPDC_D_3.2 | EPDC_Q.3 70.85,18.57 70.85,18.26 67.95,15.37 67.95,11.48 68.41,11.02 75.57,11.02 76.03,11.48 92.19,11.48 95.31,14.6 95.31,26.19 EPDC_D_3.2 | EPDC_L.1 84.95,28.78 92.64,28.78 95.23,26.19 EPDC_D_3.2
SS_SD  (via drill 0.35)
  Top 0.152: SPIESD_R_6.1 9.28,100.25 10.19,100.25 SPIESD_D_6.2 11.19,99.19 11.19,89.66 9.85,88.33 | 9.85,88.33 9.81,88.29 6.23,88.29 SDC_SDC.P2 | v11.64,51.94 11.64,46.91 ESP32.4 | v9.89,87.6 9.89,88.29 9.85,88.33
  Bottom 0.152: v11.64,51.94 11.64,85.85 v9.89,87.6
TX
  Top 0.152: ESP32.25 11.72,64.36 11.72,71.53 13.93,73.74 21.24,73.74 22.31,72.67 TP1.TP
USB_D+  (via drill 0.35)
  Top 0.152: v40.9,61.47 46.31,66.88 81.14,66.88 81.98,66.04 148.35,66.04 149.87,64.52 149.87,63.52 149.11,62.76 147.89,62.76 146.67,61.54 146.67,52.09 148.42,50.34 149.49,50.34 150.33,51.18 152.69,51.18 USBC_USBLC6-2SC6Y.1 | v28.18,51.33 28.18,50.65 24.44,46.91 ESP32.14
  Bottom 0.152: v40.9,61.47 33.21,61.47 27.49,55.75 27.49,52.02 v28.18,51.33
USB_D-  (via drill 0.35)
  Top 0.152: v134.94,48.97 149.41,48.97 149.72,49.27 152.69,49.27 USBC_USBLC6-2SC6Y.3 | v23,44.78 23,46.76 23.07,46.84 ESP32.13
  Bottom 0.152: v134.94,48.97 126.48,48.97 89.37,11.86 52.26,11.86 23,41.12 v23,44.78
VBAT
  Top 0.3: 133.64,51.71 133.64,49.58 VOLREG_MOSFET.3 | 134.78,52.86 133.64,51.71 | 134.78,52.86 135.16,52.86 BCL_MAX17048G+T10.3 BCL_MAX17048G+T10.2 | 133.64,51.71 131.58,53.77 131.12,53.77 LPBCC_C_BAT_2.1 131.05,53.7 129.14,51.79 129.14,51.1 LPBCC_MCP73831.3 | 134.78,52.86 134.55,53.09 134.55,54.15 144.38,63.98 148.57,63.98 TP3.TP
VBUS
  Top 0.3: VOLREG_D.2 120.46,39.9 118.78,41.58 VOLREG_R.2 118.86,41.73 118.86,48.29 121.52,50.95 LPBCC_C_BAT_1.1 121.52,51.1 123.28,51.1 LPBCC_CHG_LED.A 123.43,51.1 123.58,51.1 124.27,51.79 125.79,51.79 126.4,51.18 LPBCC_MCP73831.4 126.55,51.03 127.47,50.11 127.47,49.5 129.52,47.45 132.65,47.45 VOLREG_MOSFET.1 132.8,47.37 133.26,47.37 134.78,45.85 150.86,45.85 150.94,45.77 | 155.28,47.98 155.28,47.6 USBC_C_USB_2.1 | 155.28,47.98 156.19,48.89 156.19,49.73 155.74,50.19 155.28,50.19 USBC_USBLC6-2SC6Y.5 155.81,50.27 156.8,51.26 156.8,51.64 USBC_C_USB_1.1 156.73,51.79 148.57,59.94 148.57,60.7 TP14.TP | 150.94,45.77 150.94,43.56 USBC_VARISTOR.2 | 150.94,45.77 153.45,48.29 154.97,48.29 155.28,47.98
VRTC
  Top 0.3: RTC_C_SUPERCAP.1 94.62,52.55 94.17,52.09 92.03,52.09 RTC_R_CAPACITOR.2 91.88,52.09 89.6,49.81 86.55,49.81 | 86.55,49.81 86.55,51.1 RTC_COUNTER.14 | 86.55,49.81 86.55,48.51 RTC_C.1
VUSB  (via drill 0.35)
  Top 0.3: USBC_USB.A4 USBC_USB.B9 162.88,52.08 158.3,47.5 | 158.3,47.5 155.38,44.58 USBC_VARISTOR.1 | v160.5,47.5 158.3,47.5 | v160.5,61.3 160.5,59.4 163.02,56.88 USBC_USB.A9 USBC_USB.B4
  Bottom 0.3: v160.5,61.3 v160.5,47.5